# Altium project KVision_V1I1.PrjPcb (part 1 of 2)
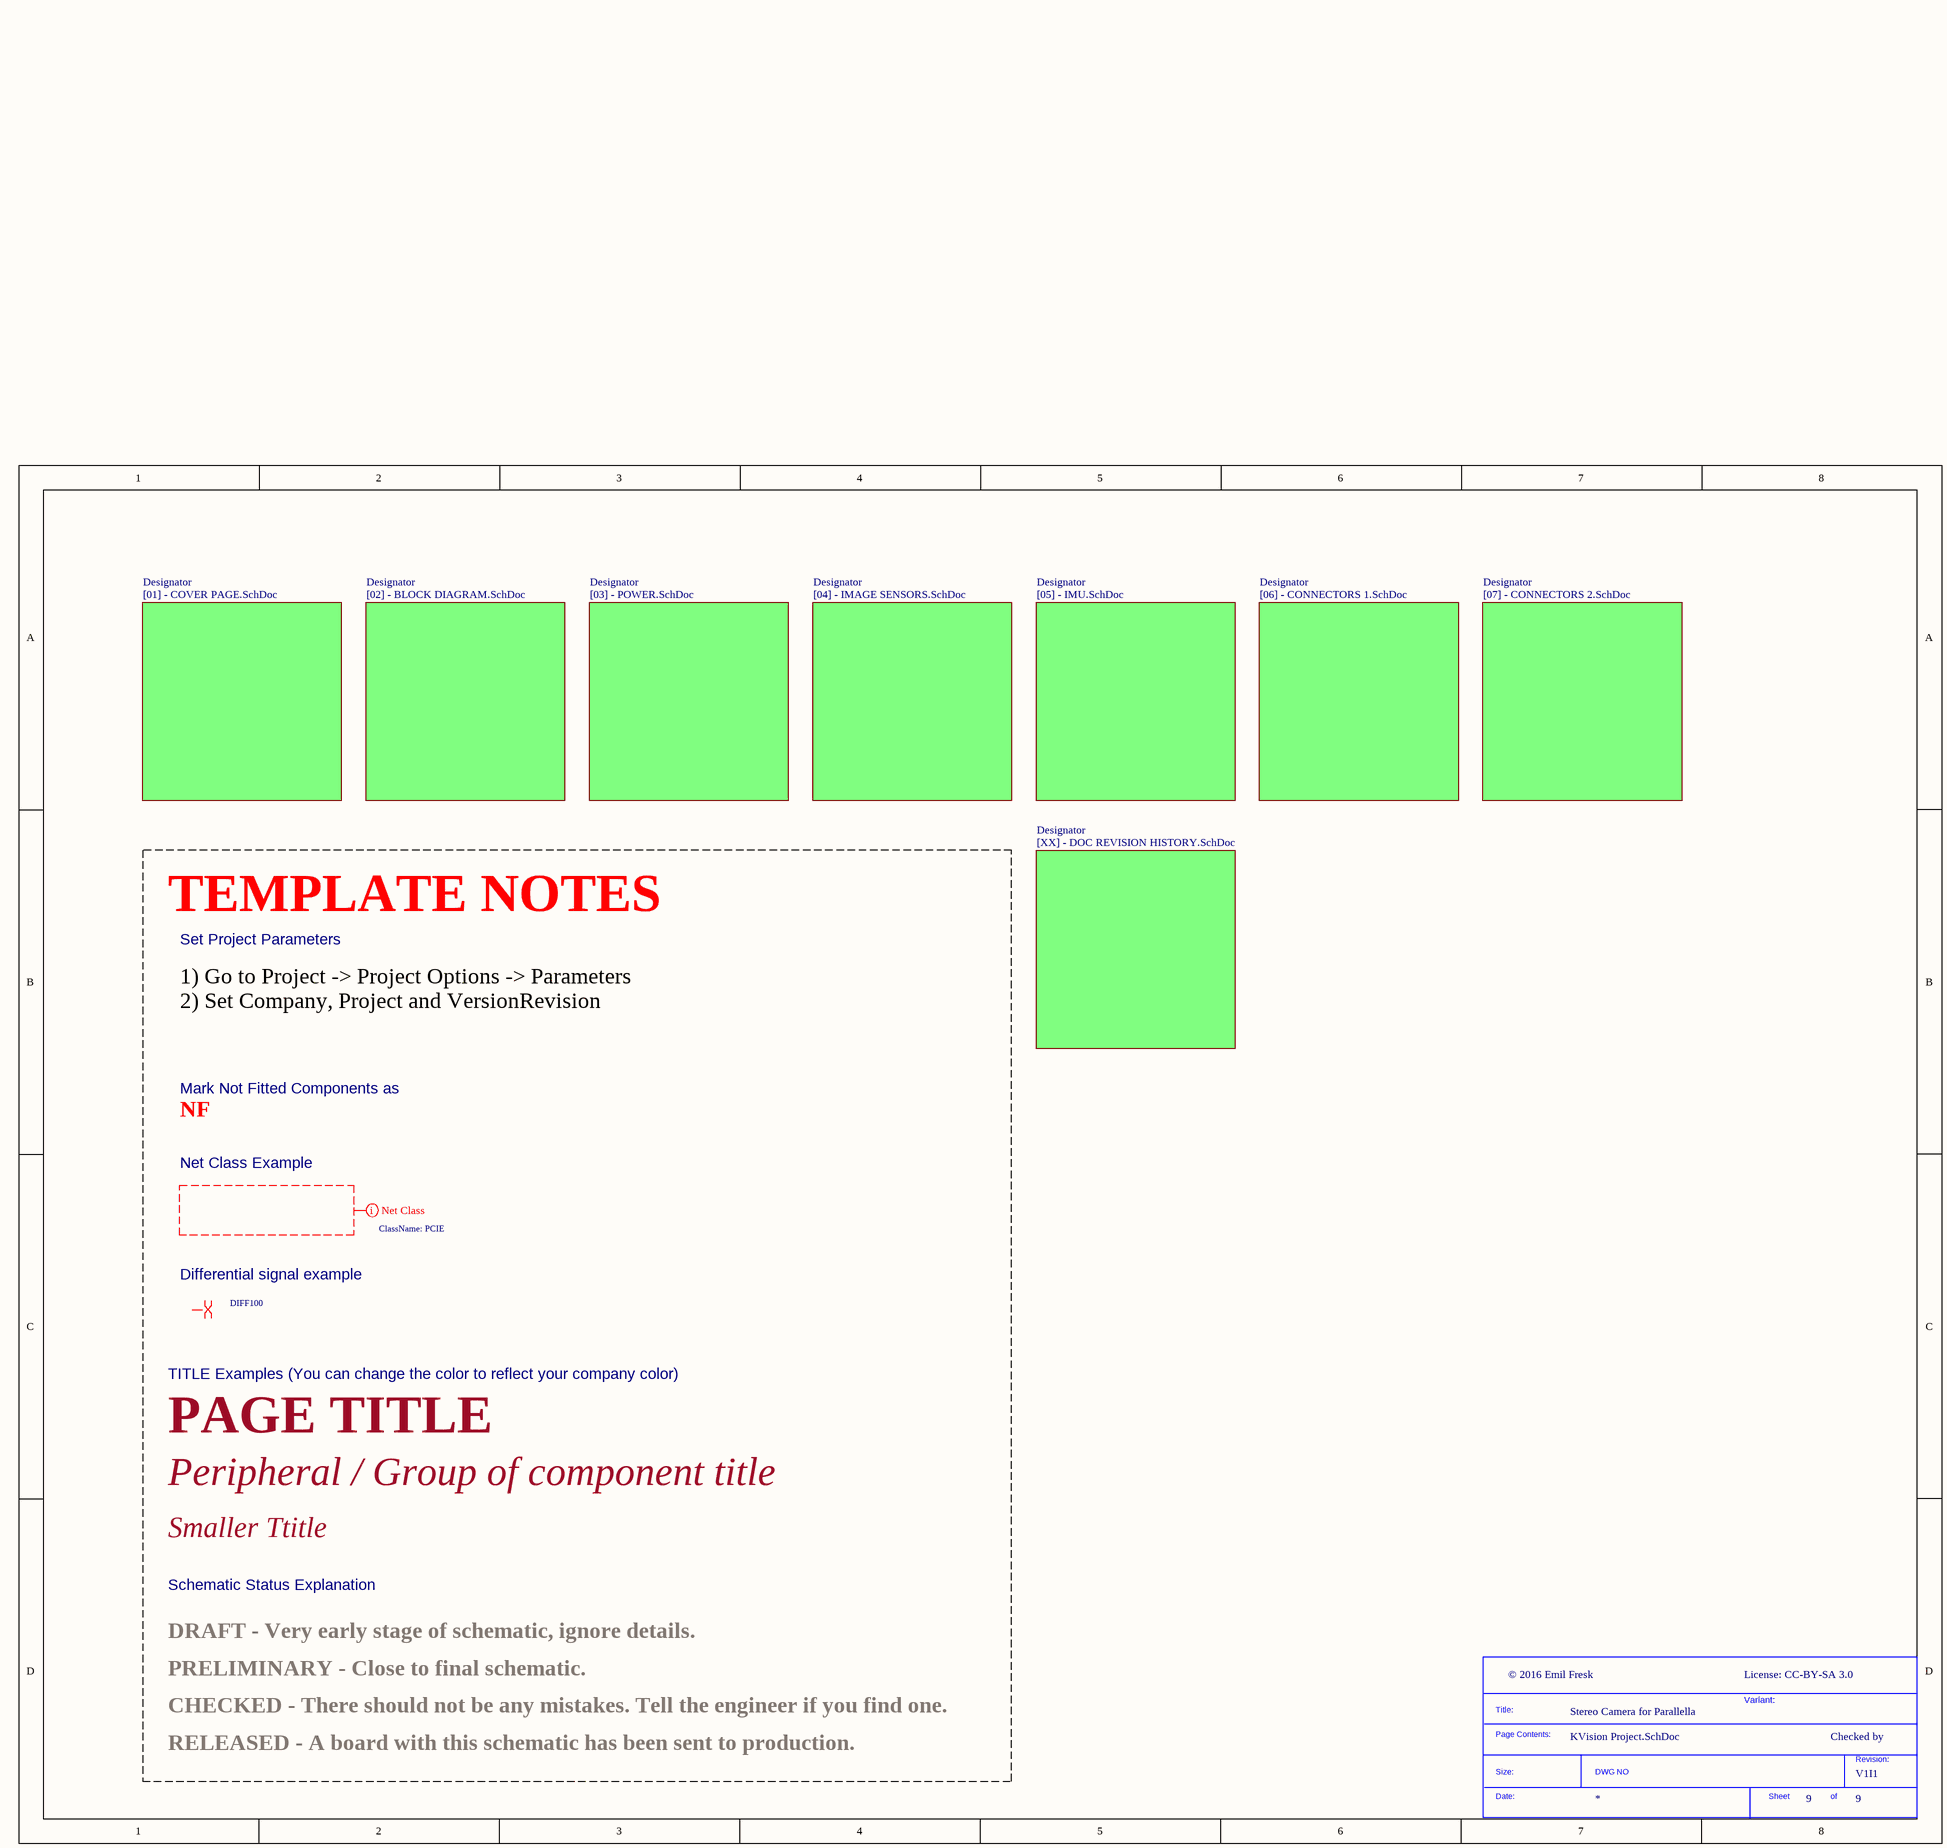
[diagram p0: KVision Project.SchDoc]
VersionRevision: V1I1; Project: Stereo Camera for Parallella; ConfidentialityNotice: License: CC-BY-SA 3.0; Company: © 2016 Emil Fresk
9 sheets, 105 parts. Net scope: global (net labels, ports and power ports of the same name join across sheets).
Board file: KVision_PCB_V1I1.PcbDoc
Sheets:
  KVision Project.SchDoc
    Designator = [01] - COVER PAGE.SchDoc
    Designator = [02] - BLOCK DIAGRAM.SchDoc
    Designator = [XX] - DOC REVISION HISTORY.SchDoc
    Designator = [03] - POWER.SchDoc
    Designator = [04] - IMAGE SENSORS.SchDoc
    Designator = [05] - IMU.SchDoc
    Designator = [06] - CONNECTORS 1.SchDoc
    Designator = [07] - CONNECTORS 2.SchDoc

## Sheet KVision Project.SchDoc
size A3; CompanyName: KDS; Organization: KDS; DocumentNumber: 9; Revision: V1I1; SheetNumber: 9; SheetTotal: 9; PageSetup: Record=PageOptions|CenterHorizontal=True|CenterVertical=True|PrintScale=1.07|XCorrection=1.00|YCorrection=1.00|PrintKind=1|BorderSize=5000000|LeftOffset=0|BottomOffset=0|Orientation=2|PaperLength=1000|PaperWidth=1000|Scale=100|PaperSource=7|PrintQuality=-3|MediaType=1|DitherType=10|PrintScaleMode=1|PaperKind=A3|PaperIndex=8; ProjectName: KDS C6A816x Module

### Parts
(Parts that share a designator on the sheet are numbered #1, #2 ... from top to bottom, then left to right.)
*#1  SDTitleBlock  (value not drawn)  (graphical)

### Sub-sheets
Designator = [01] - COVER PAGE.SchDoc: no entries
Designator = [02] - BLOCK DIAGRAM.SchDoc: no entries
Designator = [XX] - DOC REVISION HISTORY.SchDoc: no entries
Designator = [03] - POWER.SchDoc: no entries
Designator = [04] - IMAGE SENSORS.SchDoc: no entries
Designator = [05] - IMU.SchDoc: no entries
Designator = [06] - CONNECTORS 1.SchDoc: no entries
Designator = [07] - CONNECTORS 2.SchDoc: no entries

### Layout directives
net class PCIE: (no net found under the mark)
differential pair; net class DIFF100: (no net found under the mark)

### Notes on the sheet
- TEMPLATE NOTES
- Set Project Parameters
- 1) Go to Project -> Project Options -> Parameters
  2) Set Company, Project and VersionRevision
- NF
- Mark Not Fitted Components as
- Net Class Example
- Differential signal example
- TITLE Examples (You can change the color to reflect your company color)
- PAGE TITLE
- Peripheral / Group of component title
- Smaller Ttitle
- Schematic Status Explanation
- PRELIMINARY - Close to final schematic.
- DRAFT - Very early stage of schematic, ignore details.
- CHECKED - There should not be any mistakes. Tell the engineer if you find one.
- Variant:
- Checked by
- RELEASED - A board with this schematic has been sent to production.
- (in symbol SDTitleBlock) Title:; Page Contents:; Revision:; Size:; DWG NO; Date:; Sheet; of

## Sheet [01] - COVER PAGE.SchDoc
size A3; DocumentNumber: 1; SheetNumber: 1; SheetTotal: 9
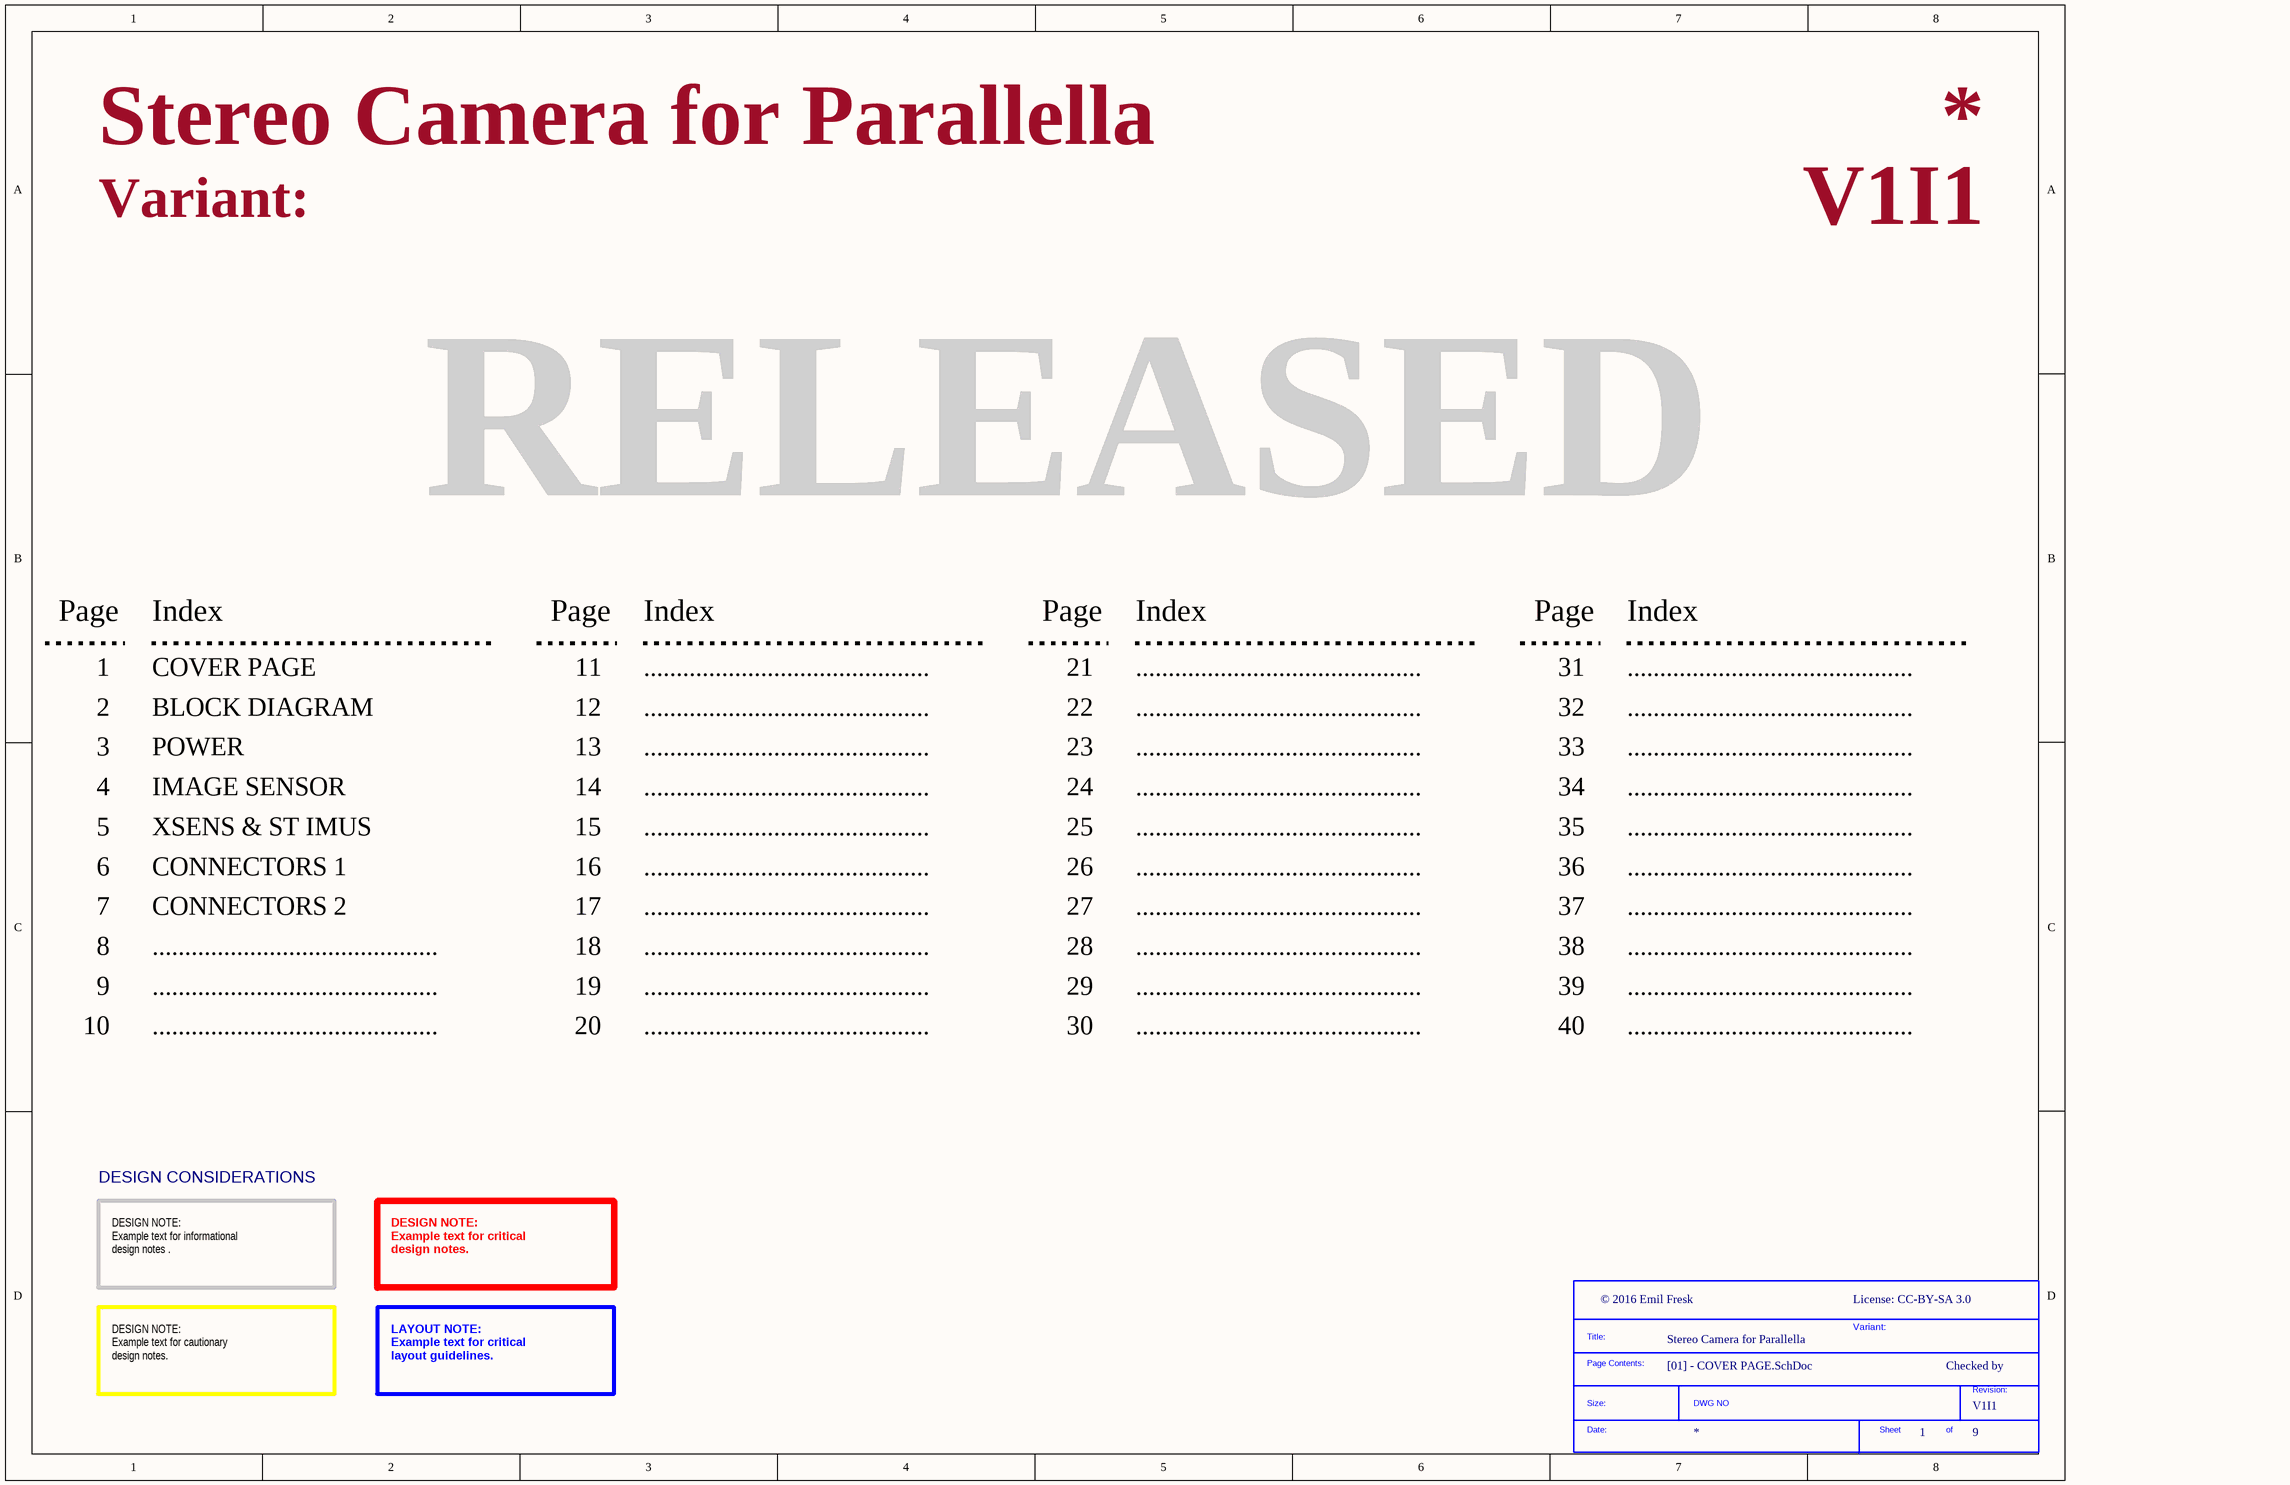
[diagram p1: [01] - COVER PAGE.SchDoc]

### Parts
(Parts that share a designator on the sheet are numbered #1, #2 ... from top to bottom, then left to right.)
*#2  SDTitleBlock  (value not drawn)  (graphical)

### Notes on the sheet
- Variant:
- RELEASED
- Page
- Index
- 1
- COVER PAGE
- 11
- ............................................
- 21
- 31
- 2
- 3
- BLOCK DIAGRAM
- POWER
- 12
- 13
- 22
- 23
- 32
- 33
- 4
- 5
- IMAGE SENSOR
- XSENS & ST IMUS
- 14
- 15
- 24
- 25
- 34
- 35
- 6
- CONNECTORS 1
- 16
- 26
- 36
- 7
- 8
- CONNECTORS 2
- 17
- 18
- 27
- 28
- 37
- 38
- 9
- 10
- 19
- 20
- 29
- 30
- 39
- 40
- DESIGN CONSIDERATIONS
- DESIGN NOTE:
  Example text for informational
  design notes .
- DESIGN NOTE:
  Example text for critical
  design notes.
- Checked by
- DESIGN NOTE:
  Example text for cautionary
  design notes.
- LAYOUT NOTE:
  Example text for critical
  layout guidelines.
- (in symbol SDTitleBlock) Title:; Page Contents:; Revision:; Size:; DWG NO; Date:; Sheet; of

## Sheet [02] - BLOCK DIAGRAM.SchDoc
size A3; DocumentNumber: 2; SheetNumber: 2; SheetTotal: 9
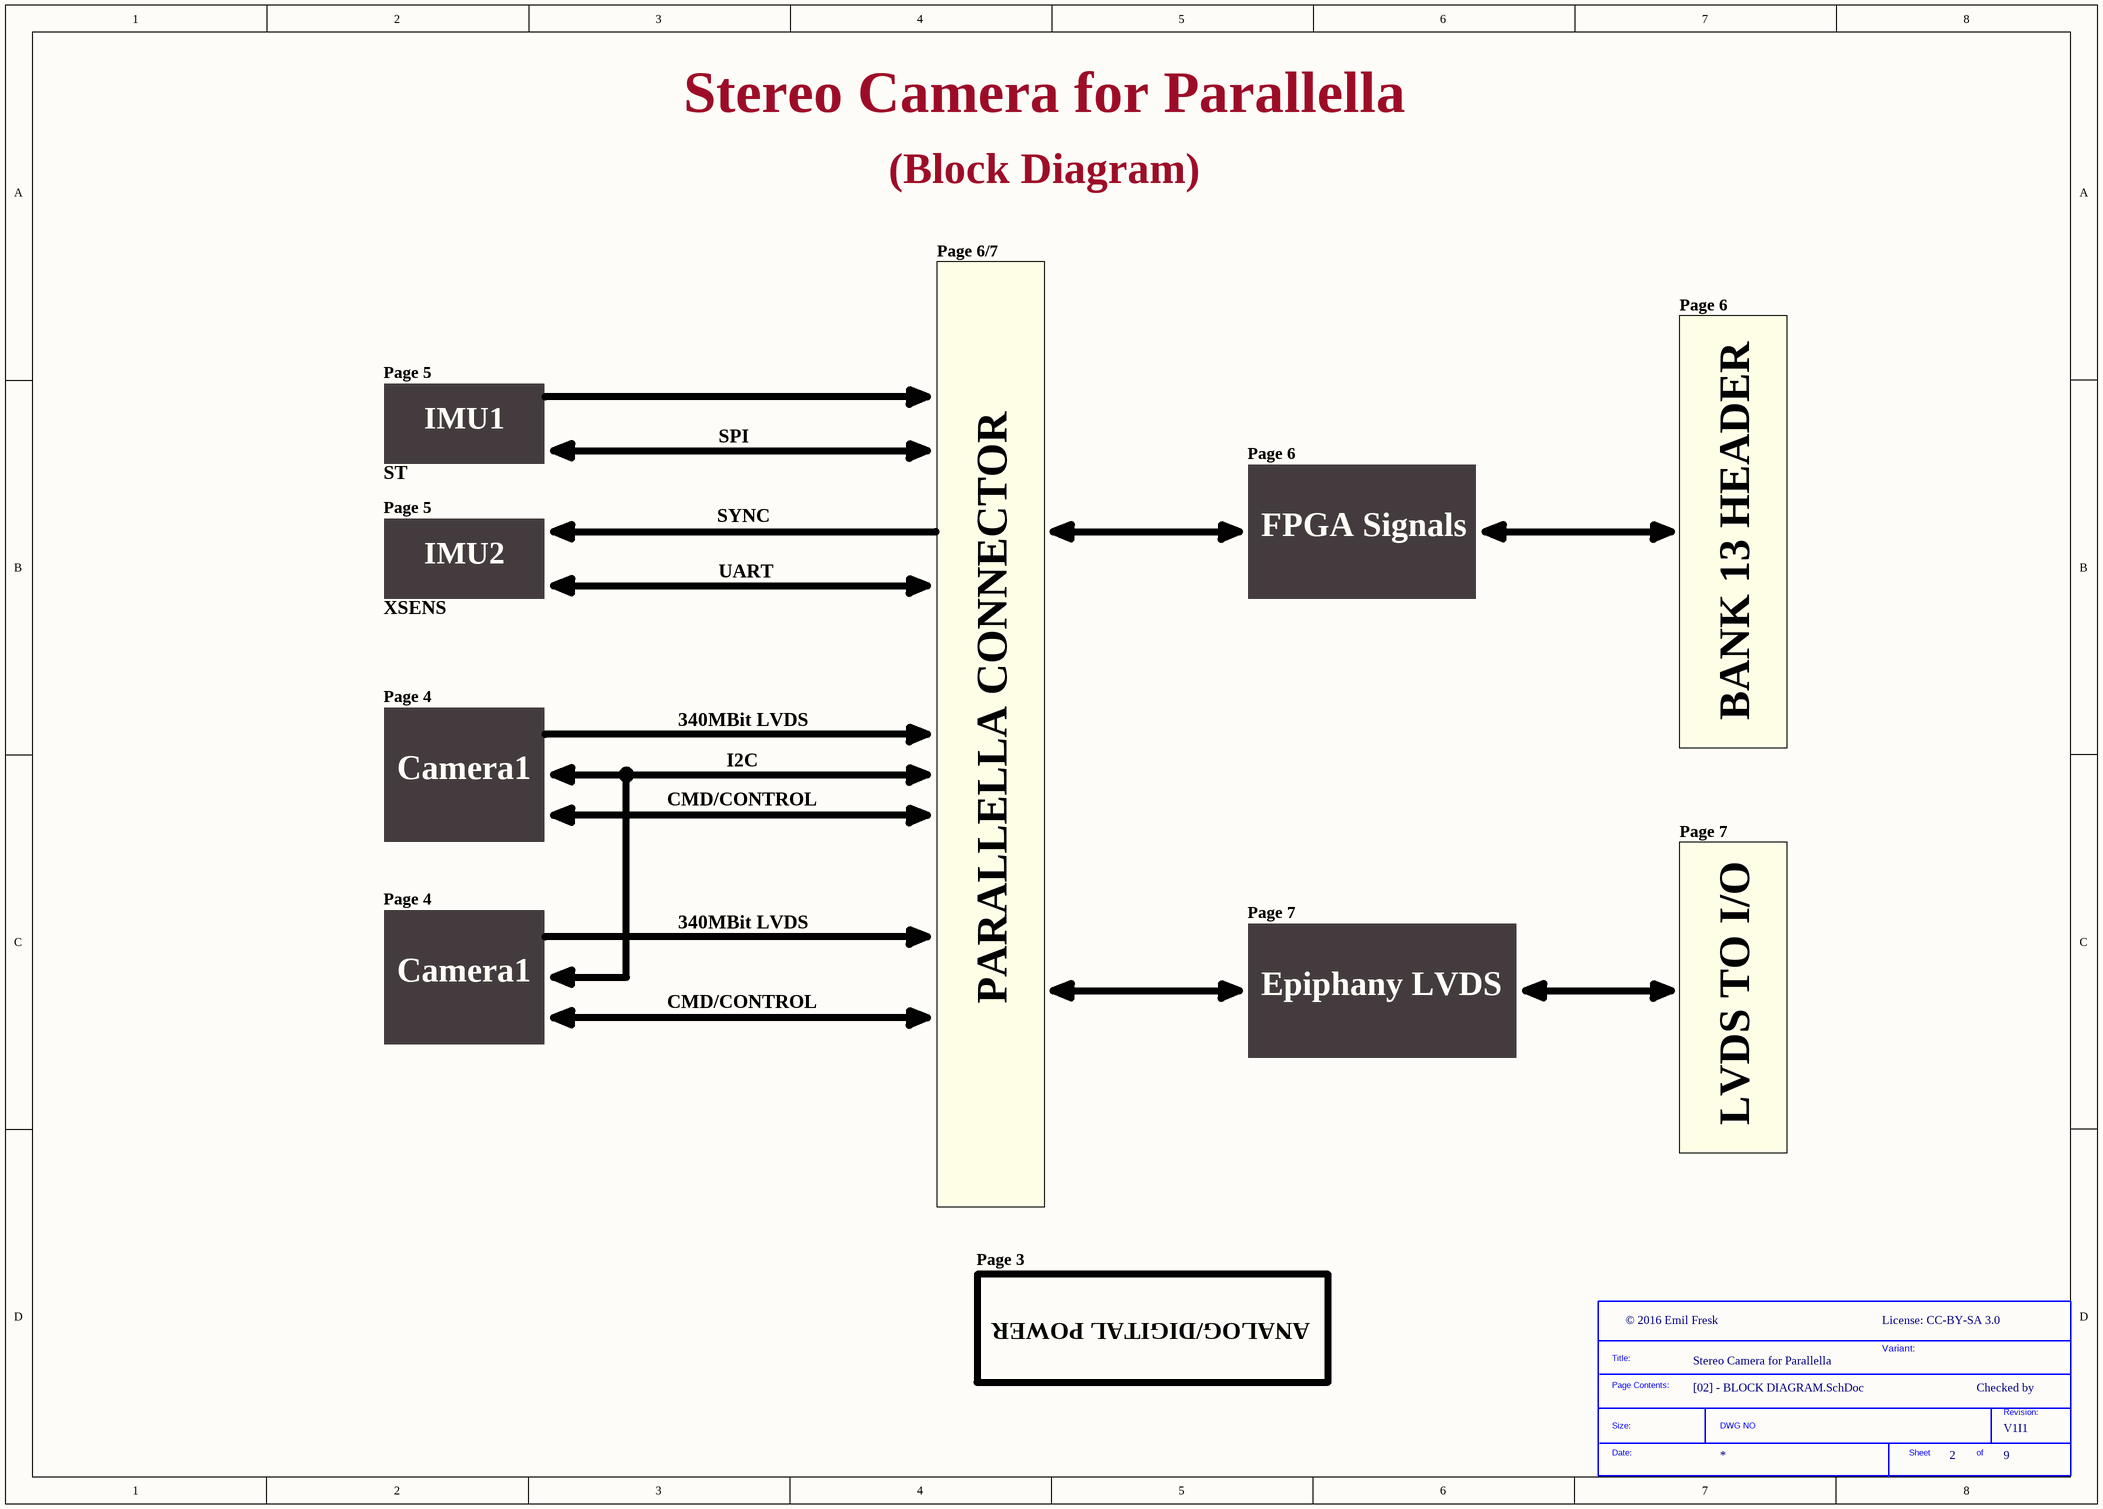
[diagram p2: [02] - BLOCK DIAGRAM.SchDoc]

### Parts
(Parts that share a designator on the sheet are numbered #1, #2 ... from top to bottom, then left to right.)
*#3  SDTitleBlock  (value not drawn)  (graphical)

### Notes on the sheet
- (Block Diagram)
- Page 6/7
- Page 6
- Page 5
- IMU1
- SPI
- ST
- IMU2
- SYNC
- UART
- FPGA Signals
- XSENS
- Page 4
- BANK 13 HEADER
- Camera1
- 340MBit LVDS
- I2C
- CMD/CONTROL
- Page 7
- PARALLELLA CONNECTOR
- Epiphany LVDS
- LVDS TO I/O
- Page 3
- ANALOG/DIGITAL POWER
- CLOCKS (CPU & PCIE)
- Variant:
- Checked by
- (in symbol SDTitleBlock) Title:; Page Contents:; Revision:; Size:; DWG NO; Date:; Sheet; of

## Sheet [XX] - DOC REVISION HISTORY.SchDoc
size A3; DocumentNumber: 8; SheetNumber: 8; SheetTotal: 9
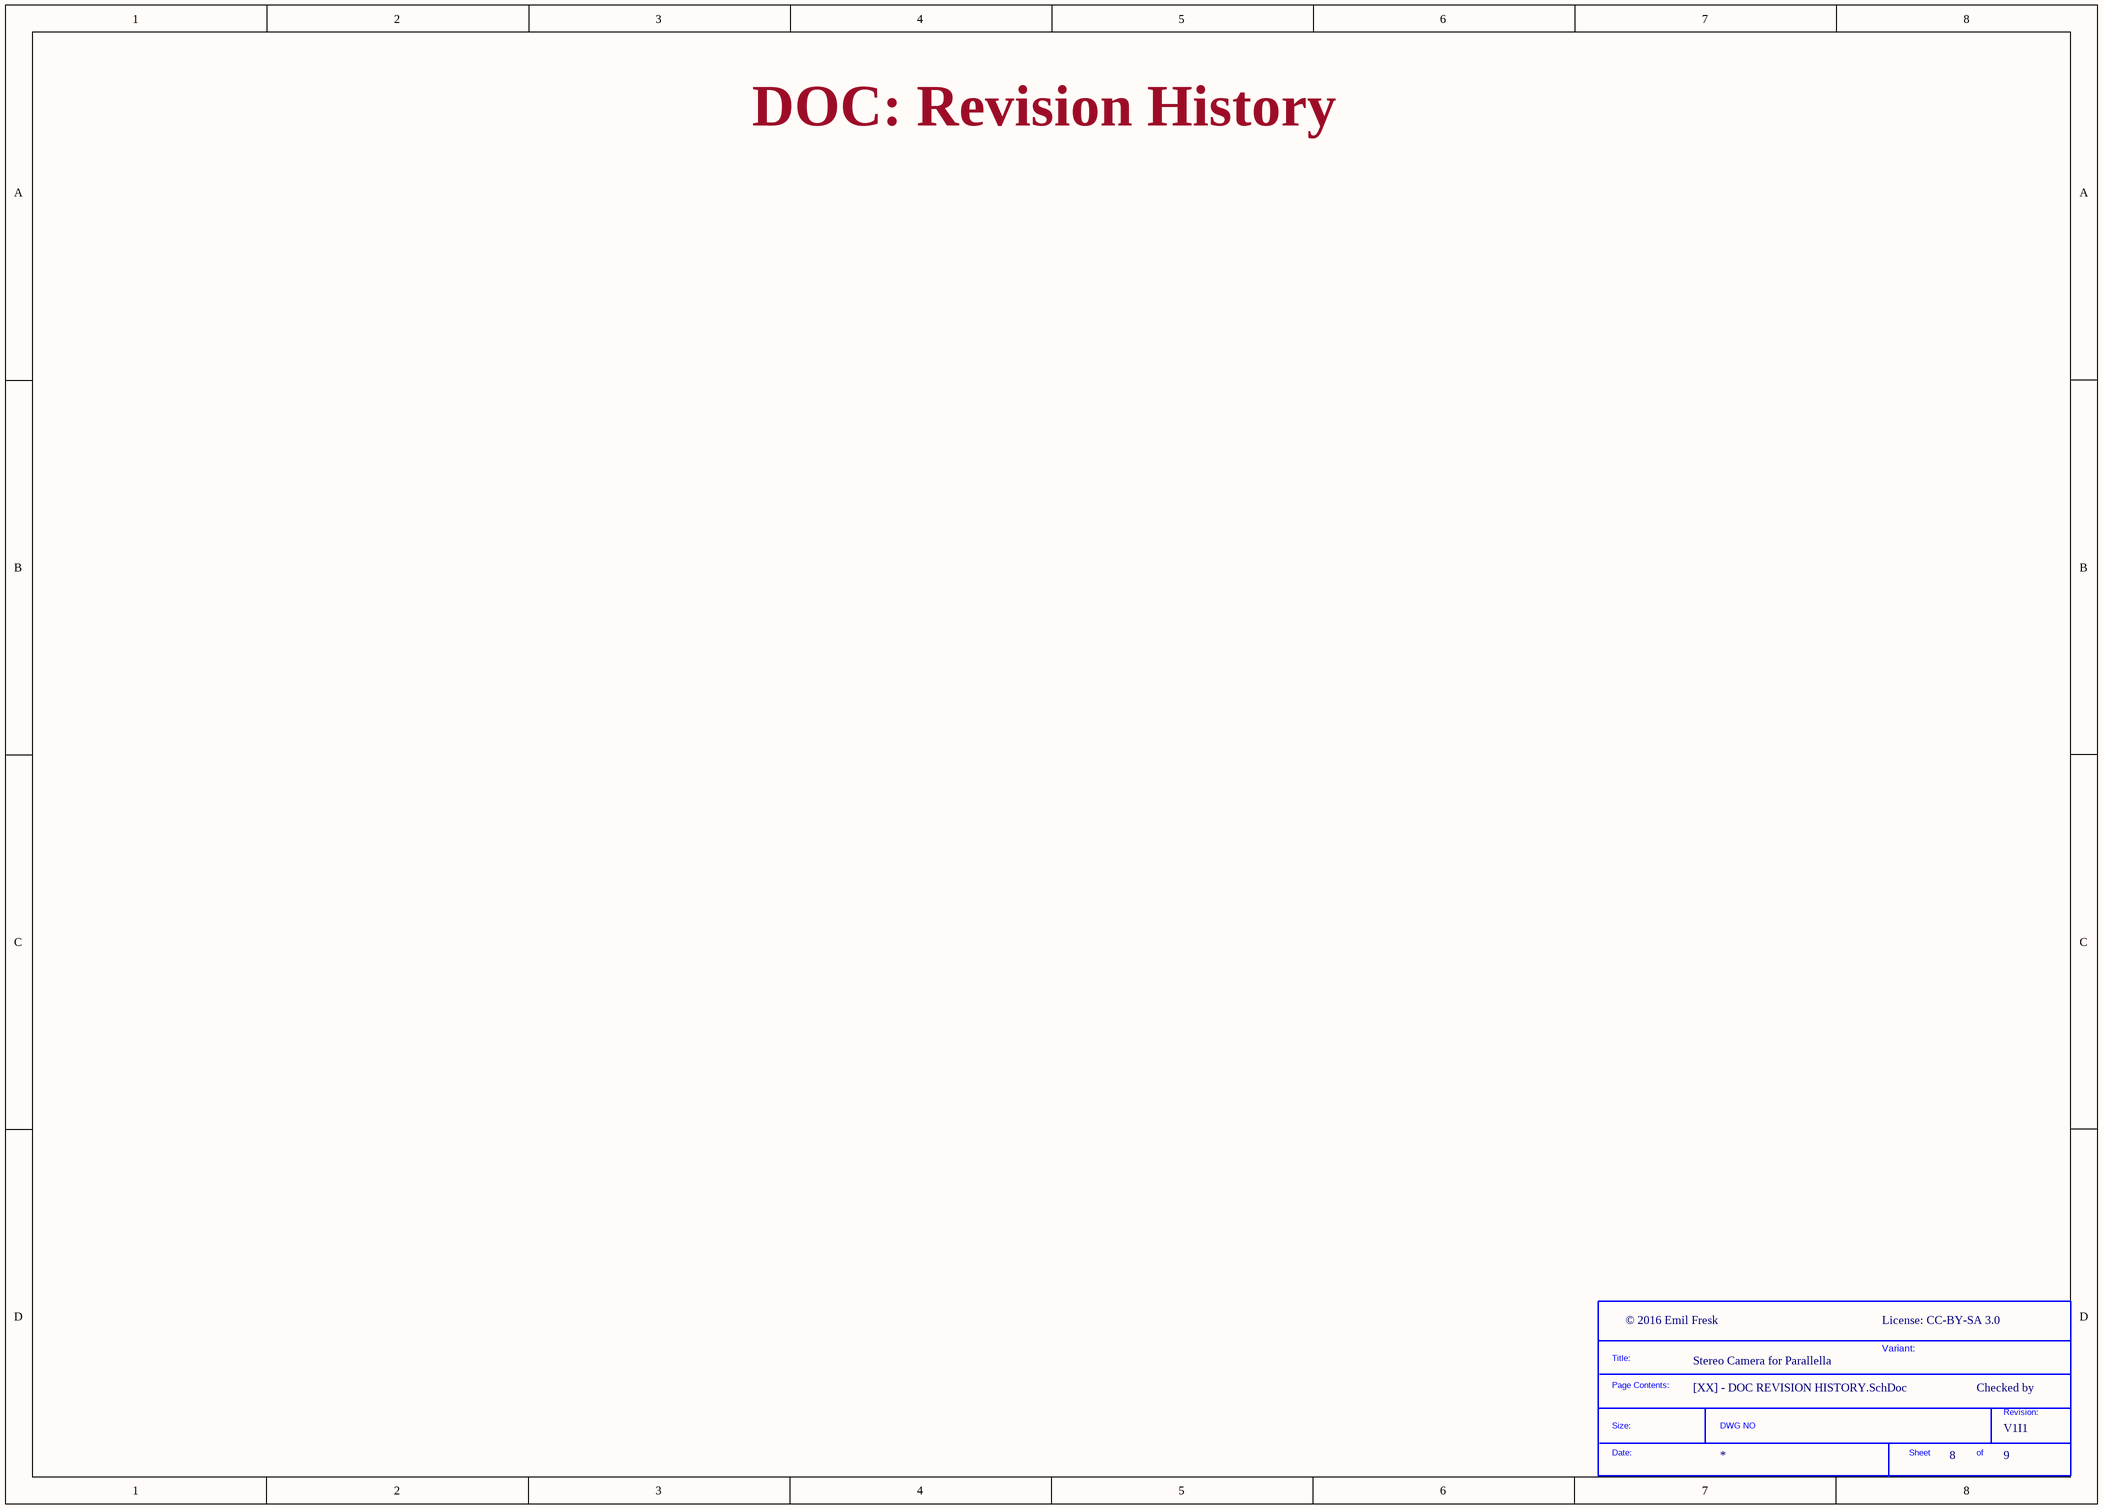
[diagram p3: [XX] - DOC REVISION HISTORY.SchDoc]

### Parts
(Parts that share a designator on the sheet are numbered #1, #2 ... from top to bottom, then left to right.)
*#4  SDTitleBlock  (value not drawn)  (graphical)

### Notes on the sheet
- DOC: Revision History
- CLOCKS (CPU & PCIE)
- Variant:
- Checked by
- (in symbol SDTitleBlock) Title:; Page Contents:; Revision:; Size:; DWG NO; Date:; Sheet; of

## Sheet [03] - POWER.SchDoc
size A3; DocumentNumber: 3; SheetNumber: 3; SheetTotal: 9
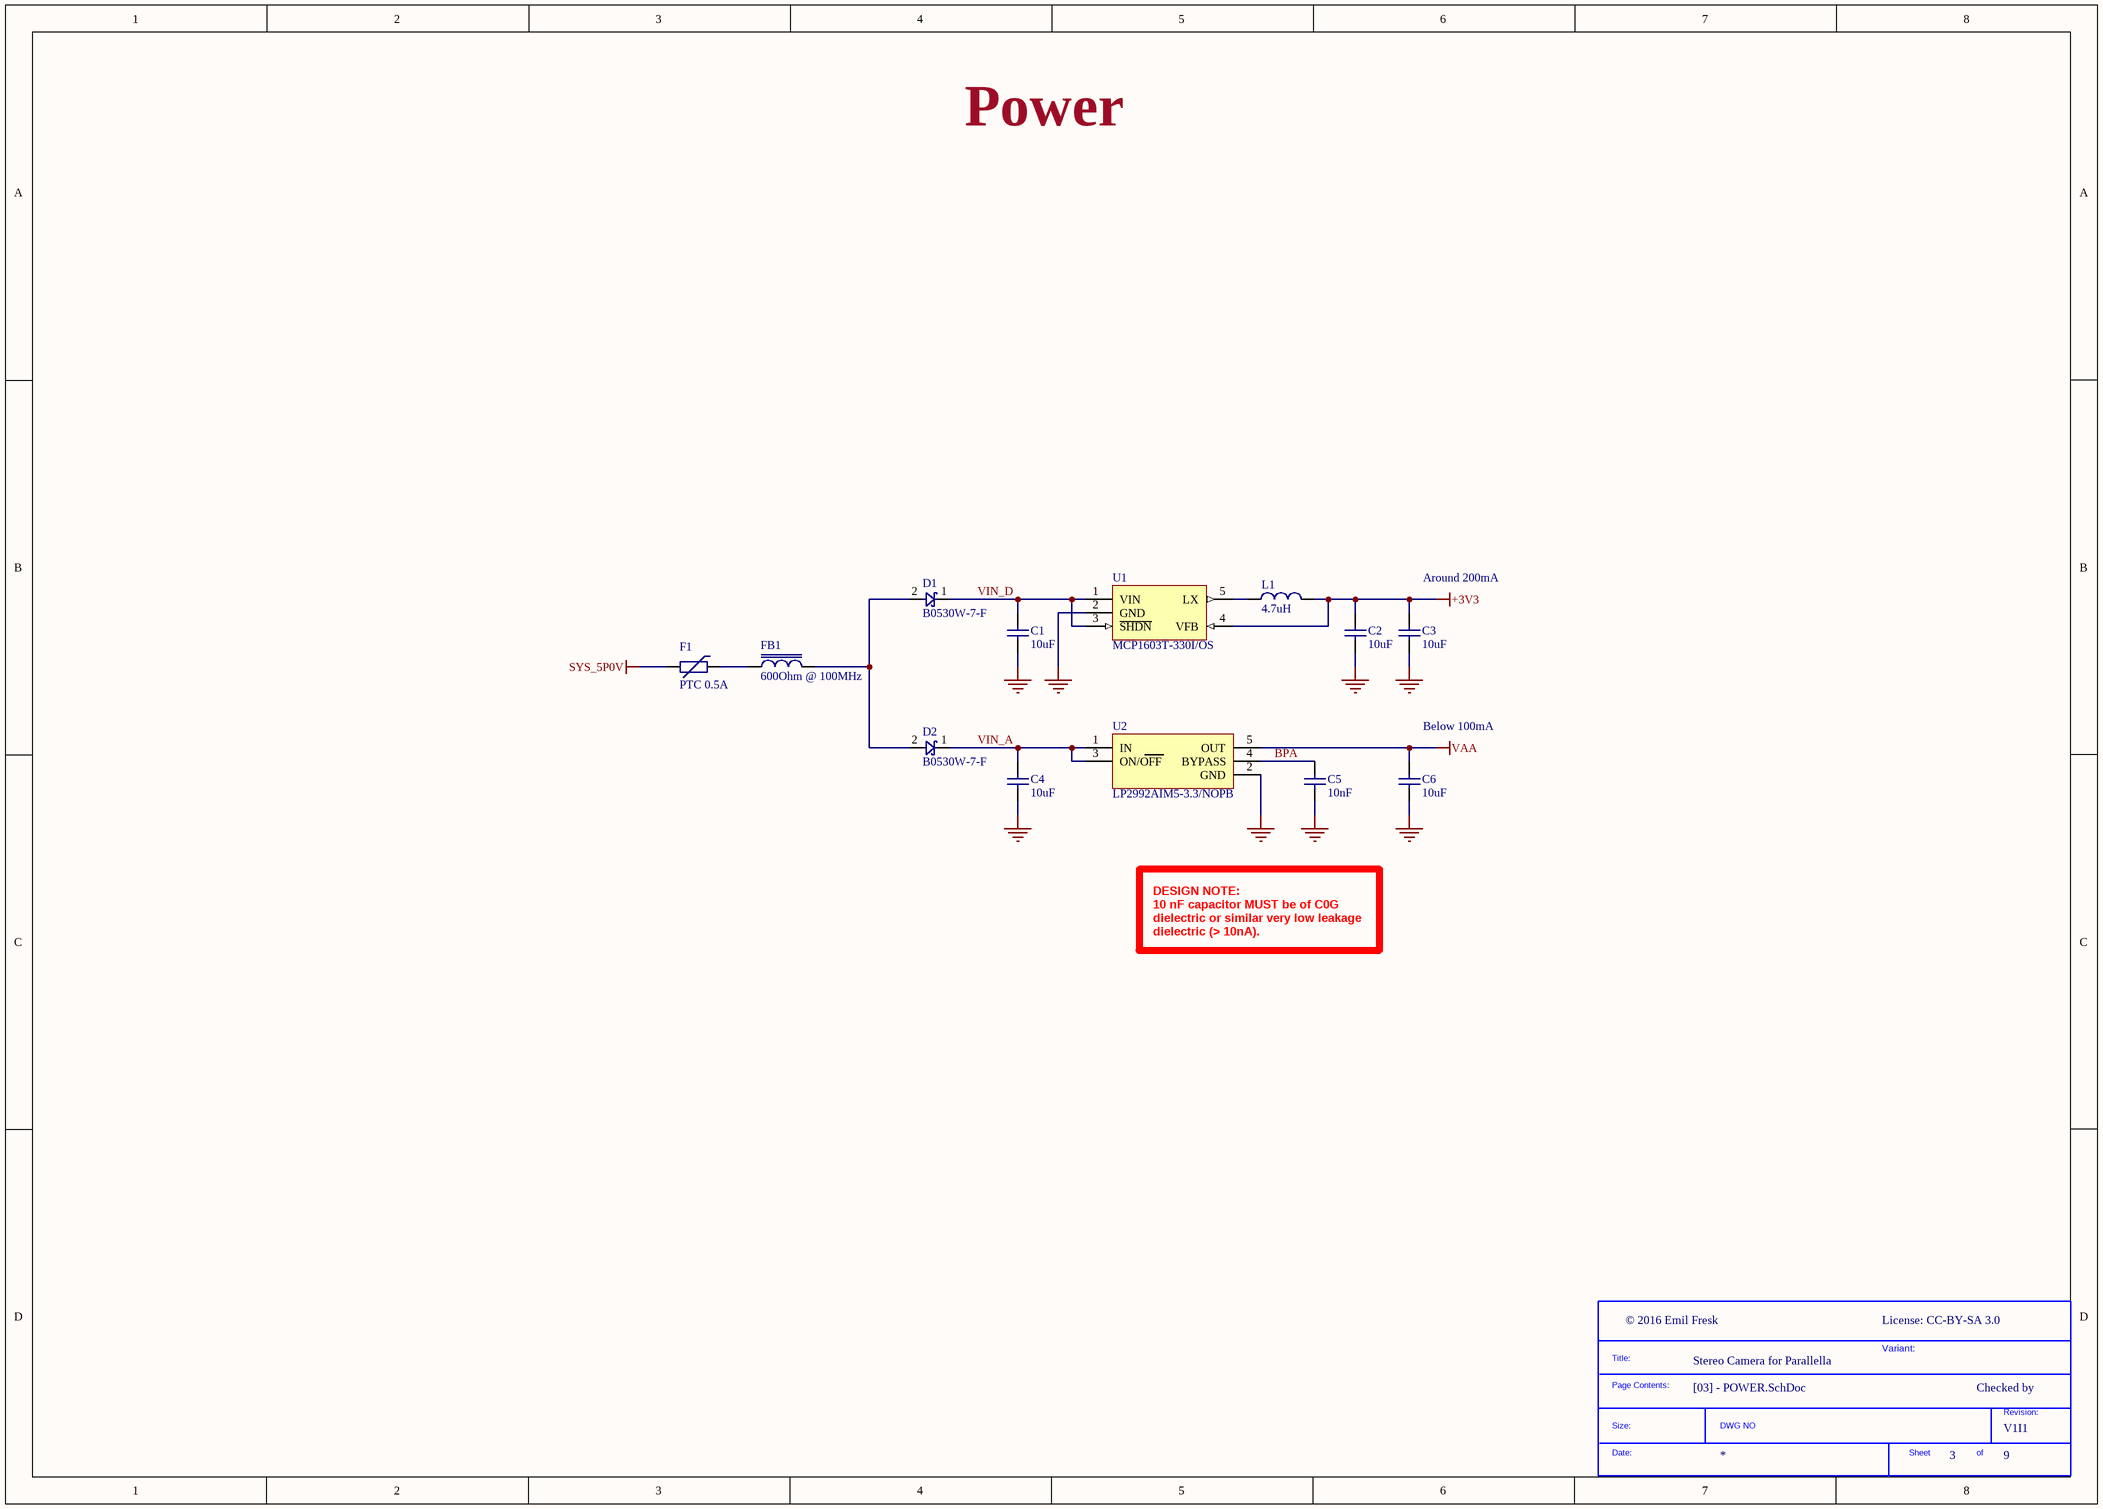
[diagram p4: [03] - POWER.SchDoc]

### Parts
(Parts that share a designator on the sheet are numbered #1, #2 ... from top to bottom, then left to right.)
*#5  SDTitleBlock  (value not drawn)  (graphical)
C1  10uF  [C0603L]
C2  10uF  [C0603L]
C3  10uF  [C0603L]
C4  10uF  [C0603L]
C5  10nF  [C0603L]
C6  10uF  [C0603L]
D1  B0530W-7-F  [SOD123_DIODE]
D2  B0530W-7-F  [SOD123_DIODE]
F1  PTC 0.5A  [FUSE_1812]
FB1  600Ohm @ 100MHz  [R0603L]
L1  4.7uH  [L_SRN3015]
U1  MCP1603T-330I/OS  [SOT23-5N]
U2  LP2992AIM5-3.3/NOPB  [SOT23-5N]

### Nets
+3V3: C2.1 C3.1 L1.2 U1.4(VFB)
GND: C1.2 C2.2 C3.2 C4.2 C5.2 C6.2 U1.2(GND) U2.2(GND)
SYS_5P0V: F1.1
VAA: C6.1 U2.5(OUT)
BPA: C5.1 U2.4(BYPASS)
VIN_A: C4.1 D2.1 U2.1(IN) U2.3(ON/OFF)
VIN_D: C1.1 D1.1 U1.1(VIN) U1.3(~{SHDN})
NetD1_2: D1.2 D2.2 FB1.2
NetF1_2: F1.2 FB1.1
NetL1_1: L1.1 U1.5(LX)

### Notes on the sheet
- Power
- (near C3) Around 200mA
- (near C6) Below 100mA
- DESIGN NOTE:
  10 nF capacitor MUST be of C0G dielectric or similar very low leakage dielectric (> 10nA).
- CLOCKS (CPU & PCIE)
- Variant:
- Checked by
- (in symbol SDTitleBlock) Title:; Page Contents:; Revision:; Size:; DWG NO; Date:; Sheet; of

### Library data of the parts
C1-C4 C6 = GRM188R61C106MA73D: CAP CER 10UF 16V 20% X5R 0603; Manufacturer: Murata Electronics North America; Capacitance: 10µF; Supplier 1: Digi-Key; Manufacturer Part Number: GRM188R61C106MA73D; RoHS: RoHS Compliant; Category: Capacitors; Stock 1: 1868; Pricing 1: 1=0.18, 10=0.171, 25=0.146, 50=0.1242, 100=0.1195, 250=0.10728, 500=0.10238, 1000=0.08532 (EUR); Packaging: Cut Tape (CT); Tolerance: ±20%; Voltage - Rated: 16V; Temperature Coefficient: X5R; Mounting Type: Surface Mount, MLCC; Operating Temperature: -55°C ~ 85°C; Applications: General Purpose; Ratings: -; Package / Case: 0603 (1608 Metric); Size / Dimension: 0.063" L x 0.031" W (1.60mm x 0.80mm); Height - Seated (Max): -; Thickness (Max): 0.031" (0.80mm); Lead Spacing: -; Features: -; Lead Style: -; ComponentLink1URL: http://www.murata.com/~/media/webrenewal/support/library/catalog/products/capacitor/mlcc/c02e.ashx; ComponentLink1Description: http://www.murata.com/~/media/webrenewal/support/library/catalog/products/capacitor/mlcc/c02e.ashx; Supplier Part Number 1: 490-7201-1-ND
C5 = C1608C0G1E103J080AA: CAP CER 10000PF 25V 5% C0G 0603; Manufacturer: TDK Corporation; Temperature Coefficient: C0G, NP0; Supplier 1: Digi-Key; Manufacturer Part Number: C1608C0G1E103J080AA; RoHS: RoHS Compliant; Category: Capacitors; Stock 1: 297001; Pricing 1: 1=0.35, 10=0.287, 100=0.1433, 250=0.10748, 500=0.09496, 1000=0.0842 (EUR); Packaging: Cut Tape (CT); Capacitance: 10000pF; Tolerance: ±5%; Voltage - Rated: 25V; Mounting Type: Surface Mount, MLCC; Operating Temperature: -55°C ~ 125°C; Applications: General Purpose; Ratings: -; Package / Case: 0603 (1608 Metric); Size / Dimension: 0.063" L x 0.031" W (1.60mm x 0.80mm); Height - Seated (Max): -; Thickness (Max): 0.037" (0.95mm); Lead Spacing: -; Features: -; Lead Style: -; ComponentLink1URL: http://product.tdk.com/en/catalog/datasheets/mlcc_commercial_general_en.pdf; ComponentLink1Description: http://product.tdk.com/en/catalog/datasheets/mlcc_commercial_general_en.pdf; Supplier Part Number 1: 445-2664-1-ND
D1 D2 = B0530W-7-F: DIODE SCHOTTKY 30V 500MA SOD123; Manufacturer: Diodes Incorporated; Voltage - Forward (Vf) (Max) @ If: 430mV @ 500mA; Speed: Fast Recovery =< 500ns, > 200mA (Io); Current - Reverse Leakage @ Vr: 130µA @ 30V; Capacitance @ Vr, F: 170pF @ 0V, 1MHz; Supplier 1: Digi-Key; Manufacturer Part Number: B0530W-7-F; RoHS: RoHS Compliant; Category: Discrete Semiconductor Products; Stock 1: 43101; Pricing 1: 1=0.31, 10=0.283, 25=0.2036, 100=0.1582, 250=0.09944, 500=0.08474, 1000=0.05774 (EUR); Packaging: Cut Tape (CT); Diode Type: Schottky; Voltage - DC Reverse (Vr) (Max): 30V; Current - Average Rectified (Io): 500mA; Reverse Recovery Time (trr): -; Mounting Type: Surface Mount; Package / Case: SOD-123; Supplier Device Package: SOD-123; Operating Temperature - Junction: -65°C ~ 125°C; ComponentLink1URL: http://www.diodes.com/datasheets/ds30139.pdf; ComponentLink1Description: http://www.diodes.com/datasheets/ds30139.pdf; Supplier Part Number 1: B0530W-FDICT-ND
F1 = 0ZCG0050AF2C: PTC RESETTBLE 0.50A 30V CHIP 181; Manufacturer: Bel Fuse Inc; Current - Max: 100A; Current - Hold (Ih) (Max): 500mA; Current - Trip (It): 1A; R Min/Max: 0.150 ~ 1.000 Ohm; Time to Trip: 0.15s; Supplier 1: Digi-Key; Manufacturer Part Number: 0ZCG0050AF2C; RoHS: RoHS Compliant; Category: Circuit Protection; Stock 1: 12558; Pricing 1: 1=0.12, 10=0.11, 25=0.1016, 100=0.0912, 250=0.08128, 500=0.06772, 1000=0.06417 (EUR); Packaging: Cut Tape (CT); Voltage - Max: 30V; Package / Case: 1812 (4532 Metric), Concave; ComponentLink1URL: http://www.belfuse.com/pdfs/0ZCG.pdf; ComponentLink1Description: http://www.belfuse.com/pdfs/0ZCG.pdf; Supplier Part Number 1: 507-1762-1-ND
FB1 = MPZ1608S601ATA00: FERRITE CHIP BEAD 600 OHM SMD; Manufacturer: TDK Corporation; Current Rating: 1A; DC Resistance (DCR): 150 mOhm Max; Filter Type: Differential Mode - Single; Supplier 1: Digi-Key; Manufacturer Part Number: MPZ1608S601ATA00; RoHS: RoHS Compliant; Category: Filters; Stock 1: 108962; Pricing 1: 1=0.09, 10=0.07, 100=0.0415, 250=0.0302, 500=0.02768, 1000=0.02391 (EUR); Packaging: Cut Tape (CT); Impedance @ Frequency: 600 Ohm @ 100MHz; Package / Case: 0603 (1608 Metric); Mounting Type: Surface Mount; Height (Max): 0.037" (0.95mm); Size / Dimension: 0.063" L x 0.031" W (1.60mm x 0.80mm); ComponentLink1URL: http://product.tdk.com/en/catalog/datasheets/beads_commercial_power_mpz_en.pdf; ComponentLink1Description: http://product.tdk.com/en/catalog/datasheets/beads_commercial_power_mpz_en.pdf; Supplier Part Number 1: 445-2205-1-ND
L1 = SRN3015-4R7M: FIXED IND 4.7UH 1.4A 136 MOHM; Manufacturer: Bourns Inc.; Type: Wirewound; Material - Core: Ferrite; Inductance: 4.7µH; Tolerance: ±20%; Current - Saturation: 1.2A; Shielding: Shielded; DC Resistance (DCR): 136 mOhm Max; Frequency - Self Resonant: 65MHz; Frequency - Test: 1MHz; Supplier 1: Digi-Key; Manufacturer Part Number: SRN3015-4R7M; RoHS: RoHS Compliant; Category: Inductors, Coils, Chokes; Stock 1: 8540; Pricing 1: 1=0.33, 10=0.293, 25=0.2744, 50=0.2378, 100=0.2195, 250=0.20856, 500=0.19026, 1000=0.16099 (EUR); Packaging: Cut Tape (CT); Current Rating: 1.4A; Q @ Freq: -; Operating Temperature: -40°C ~ 125°C; Mounting Type: Surface Mount; Package / Case: Nonstandard; Size / Dimension: 0.118" L x 0.118" W (3.00mm x 3.00mm); Height - Seated (Max): 0.059" (1.50mm); Supplier Device Package: -; ComponentLink1URL: http://www.bourns.com/data/global/pdfs/SRN3015.pdf; ComponentLink1Description: http://www.bourns.com/data/global/pdfs/SRN3015.pdf; Supplier Part Number 1: SRN3015-4R7MCT-ND
U1 = MCP1603T-330I/OS: IC REG BCK 3.3V 0.5A SYNC TSOT23; Manufacturer: Microchip Technology; Function: Step-Down; Output Configuration: Positive; Topology: Buck; Output Type: Fixed; Number of Outputs: 1; Voltage - Input (Min): 2.7V; Voltage - Input (Max): 5.5V; Current - Output: 500mA; Frequency - Switching: 2MHz; Synchronous Rectifier: Yes; Supplier 1: Digi-Key; Manufacturer Part Number: MCP1603T-330I/OS; RoHS: RoHS Compliant; Category: Integrated Circuits (ICs); Stock 1: 3738; Pricing 1: 1=1.08, 10=0.896, 25=0.75, 100=0.6769 (EUR); Packaging: Cut Tape (CT); Voltage - Output (Min/Fixed): 3.3V; Voltage - Output (Max): -; Operating Temperature: -40°C ~ 125°C (TJ); Mounting Type: Surface Mount; Package / Case: SOT-23-5 Thin, TSOT-23-5; Supplier Device Package: TSOT-23-5; ComponentLink1URL: http://www.microchip.com/mymicrochip/filehandler.aspx?ddocname=en530515; ComponentLink1Description: http://www.microchip.com/mymicrochip/filehandler.aspx?ddocname=en530515; Supplier Part Number 1: MCP1603T-330I/OSCT-ND
U2 = LP2992AIM5-3.3/NOPB: IC REG LDO 3.3V 0.25A SOT23-5; Manufacturer: Texas Instruments; Regulator Topology: Positive Fixed; Current - Output: 250mA; Voltage - Dropout (Typical): 0.45V @ 250mA; Number of Regulators: 1; Voltage - Input: Up to 16V; Supplier 1: Digi-Key; Manufacturer Part Number: LP2992AIM5-3.3/NOPB; RoHS: RoHS Compliant; Category: Integrated Circuits (ICs); Stock 1: 25697; Pricing 1: 1=1.26, 10=1.116, 25=1.0084, 50=0.9336, 100=0.8824, 250=0.7524, 500=0.66538 (EUR); Packaging: Cut Tape (CT); Voltage - Output: 3.3V; Current - Limit (Min): -; Operating Temperature: -40°C ~ 125°C; Mounting Type: Surface Mount; Package / Case: SC-74A, SOT-753; Supplier Device Package: SOT-23-5; ComponentLink1URL: http://www.ti.com/lit/ds/symlink/lp2992.pdf; ComponentLink1Description: http://www.ti.com/lit/ds/symlink/lp2992.pdf; Supplier Part Number 1: LP2992AIM5-3.3/NOPBCT-ND

## Sheet [04] - IMAGE SENSORS.SchDoc
size A3; DocumentNumber: 4; SheetNumber: 4; SheetTotal: 9
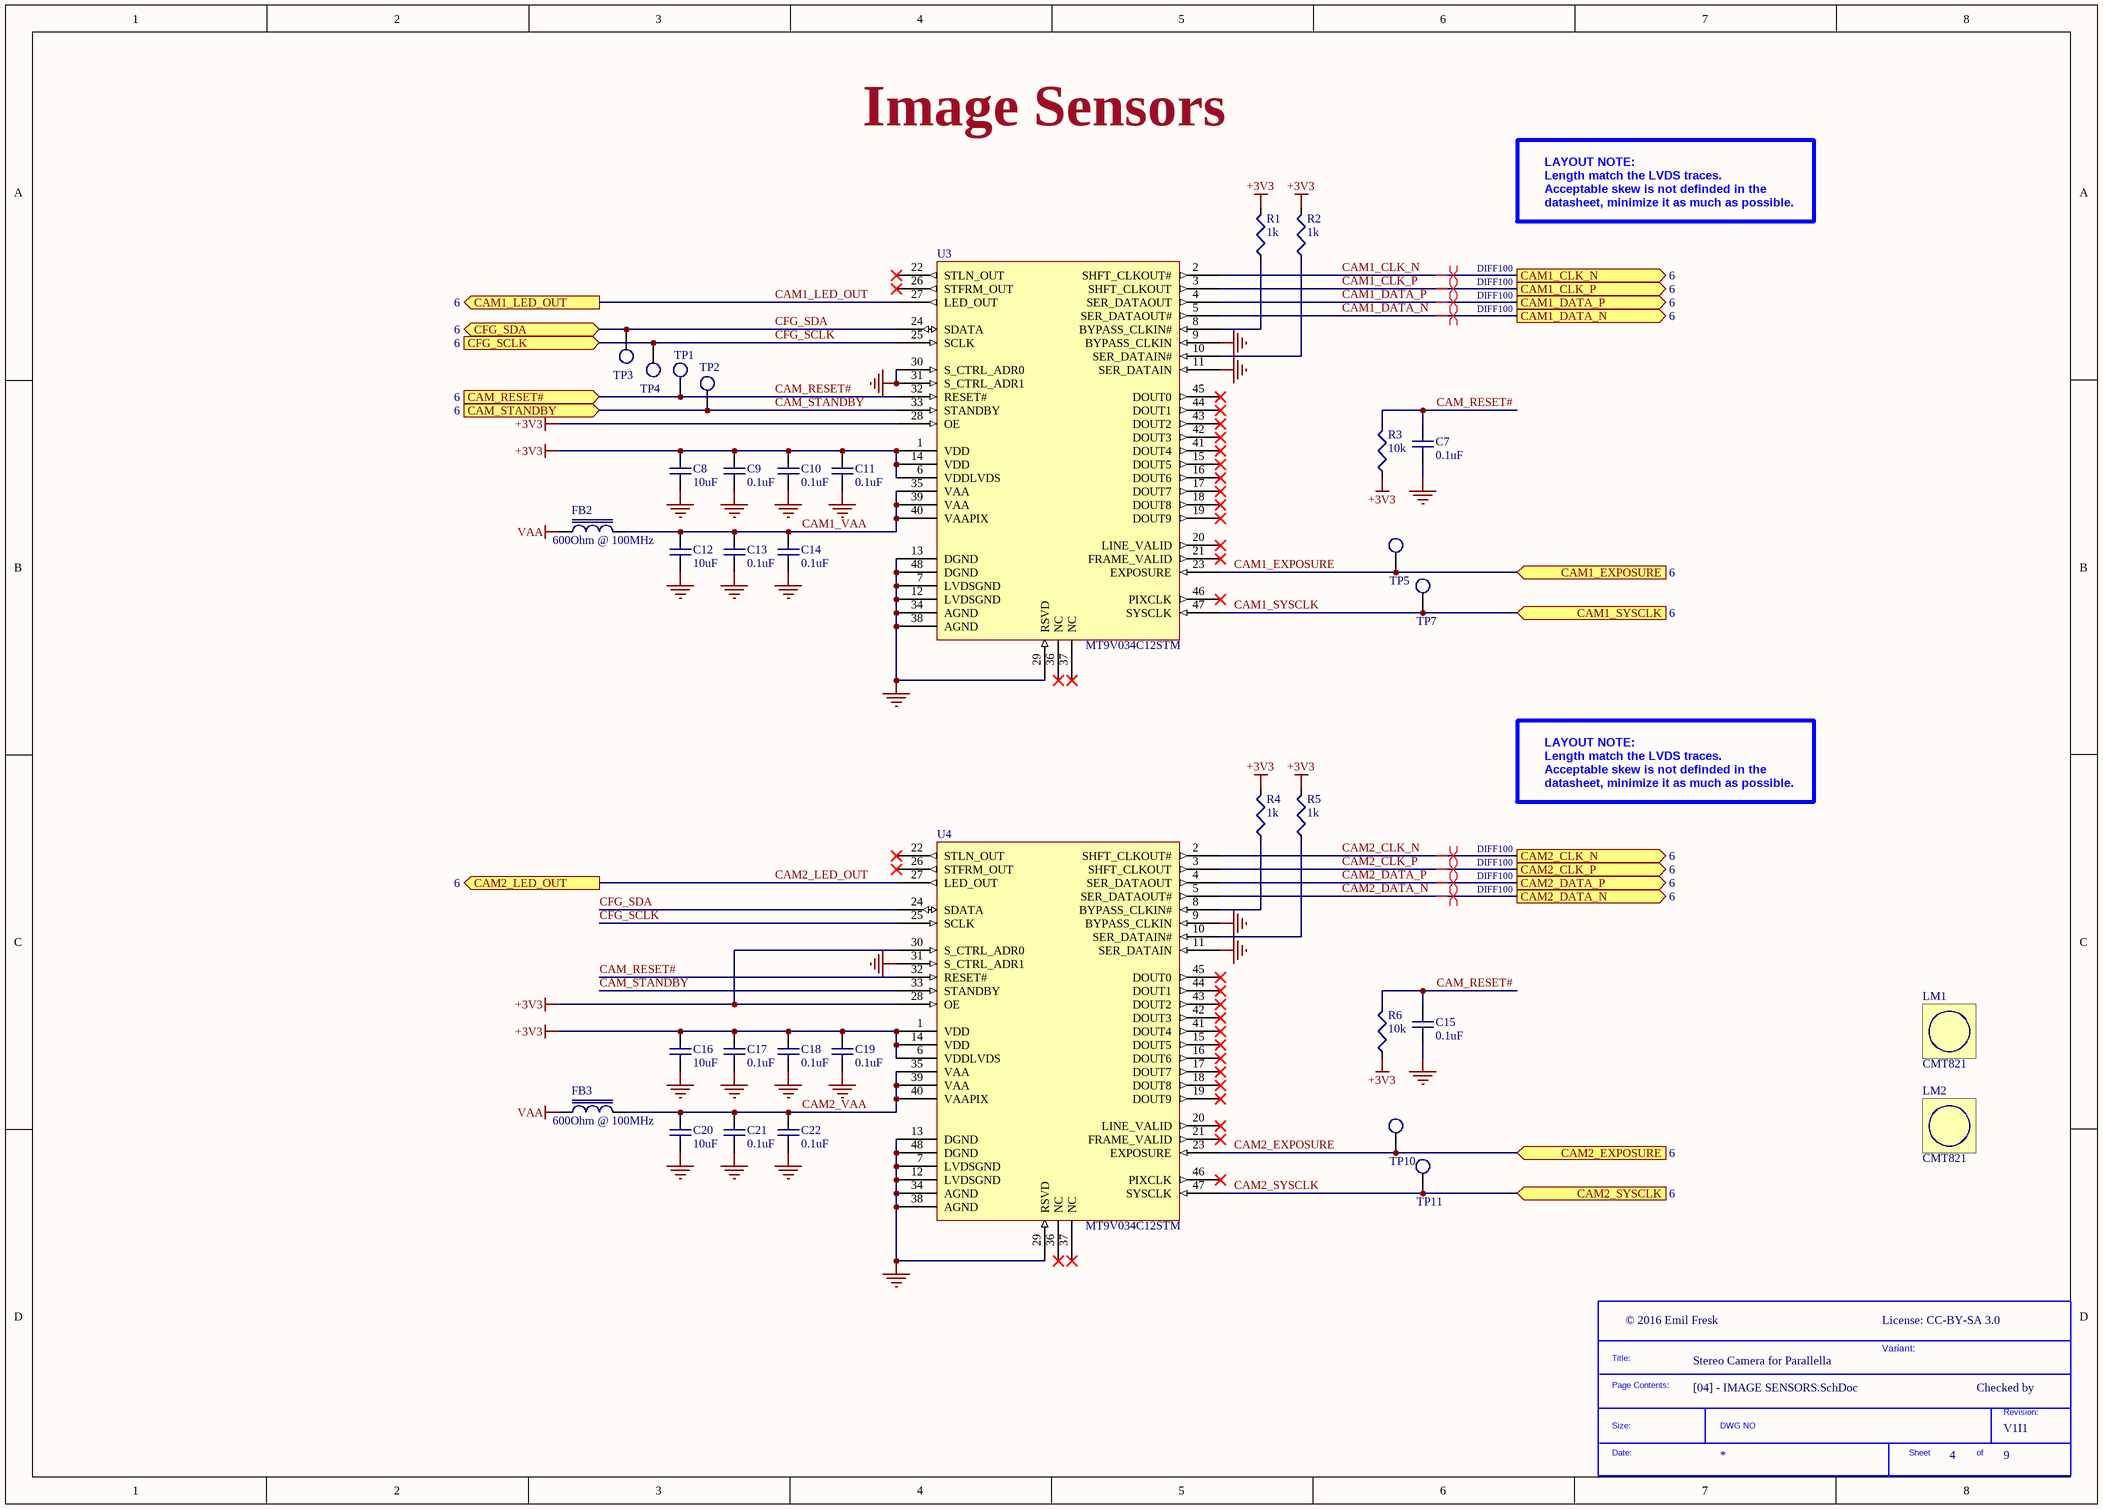
[diagram p5: [04] - IMAGE SENSORS.SchDoc]

### Parts
(Parts that share a designator on the sheet are numbered #1, #2 ... from top to bottom, then left to right.)
*#6  SDTitleBlock  (value not drawn)  (graphical)
C7  0.1uF  [C0603L]
C8  10uF  [C0603L]
C9  0.1uF  [C0603L]
C10  0.1uF  [C0603L]
C11  0.1uF  [C0603L]
C12  10uF  [C0603L]
C13  0.1uF  [C0603L]
C14  0.1uF  [C0603L]
C15  0.1uF  [C0603L]
C16  10uF  [C0603L]
C17  0.1uF  [C0603L]
C18  0.1uF  [C0603L]
C19  0.1uF  [C0603L]
C20  10uF  [C0603L]
C21  0.1uF  [C0603L]
C22  0.1uF  [C0603L]
FB2  600Ohm @ 100MHz  [R0603L]
FB3  600Ohm @ 100MHz  [R0603L]
LM1  CMT821  [CMT821 LENS HOLDER]  (no BOM)
LM2  CMT821  [CMT821 LENS HOLDER]  (no BOM)
R1  1k  [R0603L]
R2  1k  [R0603L]
R3  10k  [R0603L]
R4  1k  [R0603L]
R5  1k  [R0603L]
R6  10k  [R0603L]
TP1  TestPoint  [TestPoint_1.5mm]  (value not drawn)  (no BOM)
TP2  TestPoint  [TestPoint_1.5mm]  (value not drawn)  (no BOM)
TP3  TestPoint  [TestPoint_1.5mm]  (value not drawn)  (no BOM)
TP4  TestPoint  [TestPoint_1.5mm]  (value not drawn)  (no BOM)
TP5  TestPoint  [TestPoint_1.5mm]  (value not drawn)  (no BOM)
TP7  TestPoint  [TestPoint_1.5mm]  (value not drawn)  (no BOM)
TP10  TestPoint  [TestPoint_1.5mm]  (value not drawn)  (no BOM)
TP11  TestPoint  [TestPoint_1.5mm]  (value not drawn)  (no BOM)
U3  MT9V034C12STM  [LCC-48N_MT9V03X]
U4  MT9V034C12STM  [LCC-48N_MT9V03X]

### Ports
CAM1_CLK_N (out, see 6), CAM1_CLK_P (out, see 6), CAM1_DATA_N (out, see 6), CAM1_DATA_P (out, see 6), CAM1_EXPOSURE (in, see 6), CAM1_LED_OUT (out, see 6), CAM1_SYSCLK (in, see 6), CAM2_CLK_N (out, see 6), CAM2_CLK_P (out, see 6), CAM2_DATA_N (out, see 6), CAM2_DATA_P (out, see 6), CAM2_EXPOSURE (in, see 6), CAM2_LED_OUT (out, see 6), CAM2_SYSCLK (in, see 6), CAM_RESET# (in, see 6), CAM_STANDBY (in, see 6), CFG_SCLK (in, see 6), CFG_SDA (bidir, see 6)

### Nets
+3V3: C8.1 C9.1 C10.1 C11.1 C16.1 C17.1 C18.1 C19.1 R1.2 R2.2 R3.1 R4.2 R5.2 R6.1 U3.1(VDD) U3.6(VDDLVDS) U3.14(VDD) U3.28(OE) U4.1(VDD) U4.6(VDDLVDS) U4.14(VDD) U4.28(OE) U4.30(S_CTRL_ADR0)
GND: C7.2 C8.2 C9.2 C10.2 C11.2 C12.2 C13.2 C14.2 C15.2 C16.2 C17.2 C18.2 C19.2 C20.2 C21.2 C22.2 U3.7(LVDSGND) U3.9(BYPASS_CLKIN) U3.11(SER_DATAIN) U3.12(LVDSGND) U3.13(DGND) U3.29(RSVD) U3.30(S_CTRL_ADR0) U3.31(S_CTRL_ADR1) U3.34(AGND) U3.38(AGND) U3.48(DGND) U4.7(LVDSGND) U4.9(BYPASS_CLKIN) U4.11(SER_DATAIN) U4.12(LVDSGND) U4.13(DGND) U4.29(RSVD) U4.31(S_CTRL_ADR1) U4.34(AGND) U4.38(AGND) U4.48(DGND)
VAA: FB2.1 FB3.1
CAM1_CLK_N: U3.2(SHFT_CLKOUT#) ; port CAM1_CLK_N
CAM1_CLK_P: U3.3(SHFT_CLKOUT) ; port CAM1_CLK_P
CAM1_DATA_N: U3.5(SER_DATAOUT#) ; port CAM1_DATA_N
CAM1_DATA_P: U3.4(SER_DATAOUT) ; port CAM1_DATA_P
CAM1_EXPOSURE: TP5.1 U3.23(EXPOSURE) ; port CAM1_EXPOSURE
CAM1_LED_OUT: U3.27(LED_OUT) ; port CAM1_LED_OUT
CAM1_SYSCLK: TP7.1 U3.47(SYSCLK) ; port CAM1_SYSCLK
CAM1_VAA: C12.1 C13.1 C14.1 FB2.2 U3.35(VAA) U3.39(VAA) U3.40(VAAPIX)
CAM2_CLK_N: U4.2(SHFT_CLKOUT#) ; port CAM2_CLK_N
CAM2_CLK_P: U4.3(SHFT_CLKOUT) ; port CAM2_CLK_P
CAM2_DATA_N: U4.5(SER_DATAOUT#) ; port CAM2_DATA_N
CAM2_DATA_P: U4.4(SER_DATAOUT) ; port CAM2_DATA_P
CAM2_EXPOSURE: TP10.1 U4.23(EXPOSURE) ; port CAM2_EXPOSURE
CAM2_LED_OUT: U4.27(LED_OUT) ; port CAM2_LED_OUT
CAM2_SYSCLK: TP11.1 U4.47(SYSCLK) ; port CAM2_SYSCLK
CAM2_VAA: C20.1 C21.1 C22.1 FB3.2 U4.35(VAA) U4.39(VAA) U4.40(VAAPIX)
CAM_RESET#: C7.1 C15.1 R3.2 R6.2 TP1.1 U3.32(RESET#) U4.32(RESET#) ; port CAM_RESET#
CAM_STANDBY: TP2.1 U3.33(STANDBY) U4.33(STANDBY) ; port CAM_STANDBY
CFG_SCLK: TP4.1 U3.25(SCLK) U4.25(SCLK) ; port CFG_SCLK
CFG_SDA: TP3.1 U3.24(SDATA) U4.24(SDATA) ; port CFG_SDA
NetR1_1: R1.1 U3.8(BYPASS_CLKIN#)
NetR2_1: R2.1 U3.10(SER_DATAIN#)
NetR4_1: R4.1 U4.8(BYPASS_CLKIN#)
NetR5_1: R5.1 U4.10(SER_DATAIN#)

Not connected (* = marked no-connect by the designer): U3 15(DOUT5)* 16(DOUT6)* 17(DOUT7)* 18(DOUT8)* 19(DOUT9)* 20(LINE_VALID)* 21(FRAME_VALID)* 22(STLN_OUT)* 26(STFRM_OUT)* 36(NC)* 37(NC)* 41(DOUT4)* 42(DOUT3)* 43(DOUT2)* 44(DOUT1)* 45(DOUT0)* 46(PIXCLK)*; U4 15(DOUT5)* 16(DOUT6)* 17(DOUT7)* 18(DOUT8)* 19(DOUT9)* 20(LINE_VALID)* 21(FRAME_VALID)* 22(STLN_OUT)* 26(STFRM_OUT)* 36(NC)* 37(NC)* 41(DOUT4)* 42(DOUT3)* 43(DOUT2)* 44(DOUT1)* 45(DOUT0)* 46(PIXCLK)*

### Layout directives
differential pair; net class DIFF100: CAM1_CLK_N, CAM1_CLK_P, CAM1_DATA_N, CAM1_DATA_P, CAM2_CLK_N, CAM2_CLK_P, CAM2_DATA_N, CAM2_DATA_P

### Notes on the sheet
- Image Sensors
- LAYOUT NOTE:
  Length match the LVDS traces.
  Acceptable skew is not definded in the
  datasheet, minimize it as much as possible.
- CLOCKS (CPU & PCIE)
- Variant:
- Checked by
- (in symbol SDTitleBlock) Title:; Page Contents:; Revision:; Size:; DWG NO; Date:; Sheet; of

### Library data of the parts
C7 C9-C11 C13-C15 C17-C19 C21 C22 = GRM188R71H104KA93J: CAP CER 0.1UF 50V 10% X7R 0603; Manufacturer: Murata Electronics North America; Capacitance: 0.1µF; Supplier 1: Digi-Key; Manufacturer Part Number: GRM188R71H104KA93J; RoHS: RoHS Compliant; Category: Capacitors; Stock 1: 4487; Pricing 1: 1=0.12, 10=0.088, 50=0.048, 100=0.0405, 250=0.03316, 500=0.02838, 1000=0.02211, 5000=0.01843 (EUR); Packaging: Cut Tape (CT); Tolerance: ±10%; Voltage - Rated: 50V; Temperature Coefficient: X7R; Mounting Type: Surface Mount, MLCC; Operating Temperature: -55°C ~ 125°C; Applications: General Purpose; Ratings: -; Package / Case: 0603 (1608 Metric); Size / Dimension: 0.063" L x 0.031" W (1.60mm x 0.80mm); Height - Seated (Max): -; Thickness (Max): 0.035" (0.90mm); Lead Spacing: -; Features: -; Lead Style: -; ComponentLink1URL: http://www.murata.com/~/media/webrenewal/support/library/catalog/products/capacitor/mlcc/c02e.ashx; ComponentLink1Description: http://www.murata.com/~/media/webrenewal/support/library/catalog/products/capacitor/mlcc/c02e.ashx; Supplier Part Number 1: 490-9735-1-ND
C8 C12 C16 C20 = GRM188R61C106MA73D: as C1 on sheet [03] - POWER; Supplier 1: Digi-Key; Manufacturer Part Number: GRM188R61C106MA73D; RoHS: RoHS Compliant; Category: Capacitors; Stock 1: 1868; Pricing 1: 1=0.18, 10=0.171, 25=0.146, 50=0.1242, 100=0.1195, 250=0.10728, 500=0.10238, 1000=0.08532 (EUR); Packaging: Cut Tape (CT); Tolerance: ±20%; Voltage - Rated: 16V; Temperature Coefficient: X5R; Mounting Type: Surface Mount, MLCC; Operating Temperature: -55°C ~ 85°C; Applications: General Purpose; Ratings: -; Package / Case: 0603 (1608 Metric); Size / Dimension: 0.063" L x 0.031" W (1.60mm x 0.80mm); Height - Seated (Max): -; Thickness (Max): 0.031" (0.80mm); Lead Spacing: -; Features: -; Lead Style: -; ComponentLink1URL: http://www.murata.com/~/media/webrenewal/support/library/catalog/products/capacitor/mlcc/c02e.ashx; ComponentLink1Description: http://www.murata.com/~/media/webrenewal/support/library/catalog/products/capacitor/mlcc/c02e.ashx; Supplier Part Number 1: 490-7201-1-ND
FB2 FB3 = MPZ1608S601ATA00: as FB1 on sheet [03] - POWER; Supplier 1: Digi-Key; Manufacturer Part Number: MPZ1608S601ATA00; RoHS: RoHS Compliant; Category: Filters; Stock 1: 108962; Pricing 1: 1=0.09, 10=0.07, 100=0.0415, 250=0.0302, 500=0.02768, 1000=0.02391 (EUR); Packaging: Cut Tape (CT); Impedance @ Frequency: 600 Ohm @ 100MHz; Package / Case: 0603 (1608 Metric); Mounting Type: Surface Mount; Height (Max): 0.037" (0.95mm); Size / Dimension: 0.063" L x 0.031" W (1.60mm x 0.80mm); ComponentLink1URL: http://product.tdk.com/en/catalog/datasheets/beads_commercial_power_mpz_en.pdf; ComponentLink1Description: http://product.tdk.com/en/catalog/datasheets/beads_commercial_power_mpz_en.pdf; Supplier Part Number 1: 445-2205-1-ND
LM1 LM2 = CMT821 LENS MOUNT
R1 R2 R4 R5 = CRCW06031K00FKEA: RES SMD 1K OHM 1% 1/10W 0603; Manufacturer: Vishay Dale; Power (Watts): 0.1W, 1/10W; Temperature Coefficient: ±100ppm/°C; Supplier 1: Digi-Key; Manufacturer Part Number: CRCW06031K00FKEA; RoHS: RoHS Compliant; Category: Resistors; Stock 1: 831888; Pricing 1: 10=0.077, 50=0.0416, 200=0.02385, 1000=0.01628 (EUR); Packaging: Cut Tape (CT); Resistance (Ohms): 1k; Tolerance: ±1%; Composition: Thick Film; Features: Automotive AEC-Q200; Operating Temperature: -55°C ~ 155°C; Package / Case: 0603 (1608 Metric); Supplier Device Package: 0603 (1608 Metric); Size / Dimension: 0.061" L x 0.033" W (1.55mm x 0.85mm); Height: 0.020" (0.50mm); Number of Terminations: 2; ComponentLink1URL: http://www.vishay.com/docs/20035/dcrcwe3.pdf; ComponentLink1Description: http://www.vishay.com/docs/20035/dcrcwe3.pdf; Supplier Part Number 1: 541-1.00KHCT-ND
R3 R6 = CRCW060310K0FKEA: RES SMD 10K OHM 1% 1/10W 0603; Manufacturer: Vishay Dale; Power (Watts): 0.1W, 1/10W; Temperature Coefficient: ±100ppm/°C; Supplier 1: Digi-Key; Manufacturer Part Number: CRCW060310K0FKEA; RoHS: RoHS Compliant; Category: Resistors; Stock 1: 2971108; Pricing 1: 10=0.077, 50=0.0416, 200=0.02385, 1000=0.01628 (EUR); Packaging: Cut Tape (CT); Resistance (Ohms): 10k; Tolerance: ±1%; Composition: Thick Film; Features: Automotive AEC-Q200; Operating Temperature: -55°C ~ 155°C; Package / Case: 0603 (1608 Metric); Supplier Device Package: 0603 (1608 Metric); Size / Dimension: 0.061" L x 0.033" W (1.55mm x 0.85mm); Height: 0.020" (0.50mm); Number of Terminations: 2; ComponentLink1URL: http://www.vishay.com/docs/20035/dcrcwe3.pdf; ComponentLink1Description: http://www.vishay.com/docs/20035/dcrcwe3.pdf; Supplier Part Number 1: 541-10.0KHCT-ND
U3 U4 = MT9V034C12STM: SENSOR IMAGE VGA MONO 48-CLCC; Manufacturer: Aptina LLC; Pixel Size: 6µm x 6µm; Active Pixel Array: 752H x 480V; Frames per Second: 60; Voltage - Supply: 3.3V; Supplier 1: Digi-Key; Manufacturer Part Number: MT9V034C12STM; RoHS: RoHS Compliant; Category: Sensors, Transducers; Stock 1: 0; Pricing 1: 152=12.75178 (EUR); Packaging: Tray; Type: CMOS Imaging; Package / Case: 48-CLCC; Supplier Device Package: 48-CLCC; Note: *; ComponentLink1URL: http://media.digikey.com/pdf/Data%20Sheets/APTINA%20PDFs/MT9V034.pdf; ComponentLink1Description: http://media.digikey.com/pdf/Data%20Sheets/APTINA%20PDFs/MT9V034.pdf; Supplier Part Number 1: 557-1454-ND

## Sheet [05] - IMU.SchDoc
size A3; DocumentNumber: 5; SheetNumber: 5; SheetTotal: 9
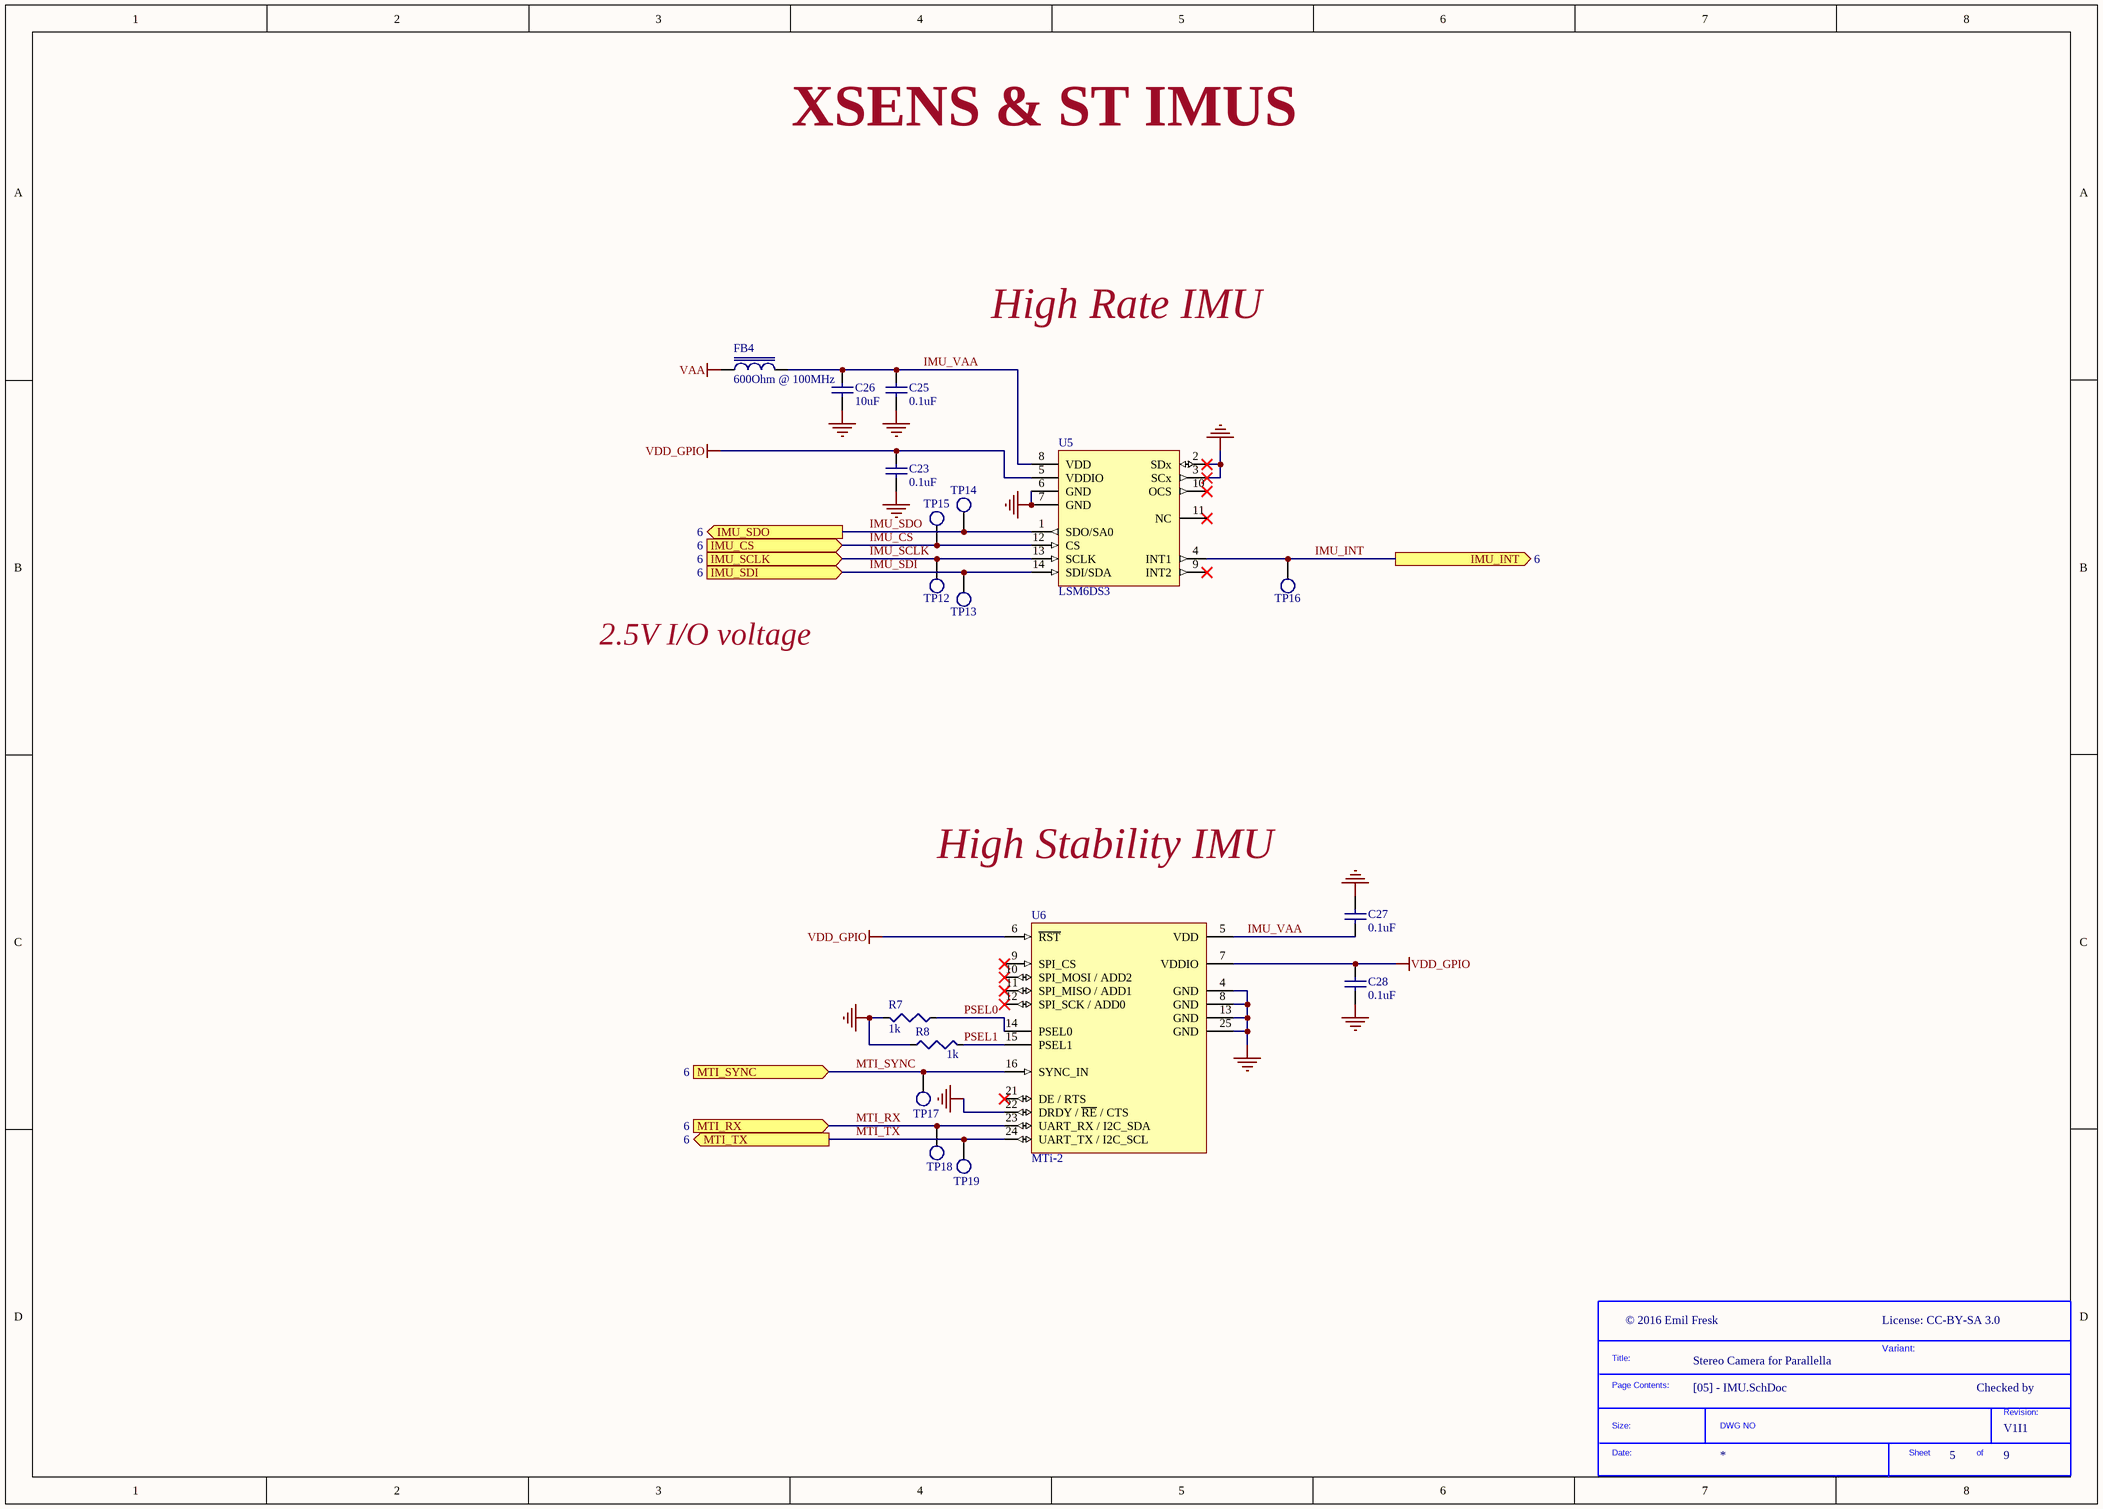
[diagram p6: [05] - IMU.SchDoc]

### Parts
(Parts that share a designator on the sheet are numbered #1, #2 ... from top to bottom, then left to right.)
*#7  SDTitleBlock  (value not drawn)  (graphical)
C23  0.1uF  [C0603L]
C25  0.1uF  [C0603L]
C26  10uF  [C0603L]
C27  0.1uF  [C0603L]
C28  0.1uF  [C0603L]
FB4  600Ohm @ 100MHz  [R0603L]
R7  1k  [R0603L]
R8  1k  [R0603L]
TP12  TestPoint  [TestPoint_1.5mm]  (value not drawn)  (no BOM)
TP13  TestPoint  [TestPoint_1.5mm]  (value not drawn)  (no BOM)
TP14  TestPoint  [TestPoint_1.5mm]  (value not drawn)  (no BOM)
TP15  TestPoint  [TestPoint_1.5mm]  (value not drawn)  (no BOM)
TP16  TestPoint  [TestPoint_1.5mm]  (value not drawn)  (no BOM)
TP17  TestPoint  [TestPoint_1.5mm]  (value not drawn)  (no BOM)
TP18  TestPoint  [TestPoint_1.5mm]  (value not drawn)  (no BOM)
TP19  TestPoint  [TestPoint_1.5mm]  (value not drawn)  (no BOM)
U5  LSM6DS3  [LGA14-N]
U6  MTi-2  [MTi-1]

### Ports
IMU_CS (in, see 6), IMU_INT (out, see 6), IMU_SCLK (in, see 6), IMU_SDI (in, see 6), IMU_SDO (out, see 6), MTI_RX (in, see 6), MTI_SYNC (in, see 6), MTI_TX (out, see 6)

### Nets
GND: C23.2 C25.2 C26.2 C27.1 C28.2 R7.2 R8.1 U5.2(SDx) U5.3(SCx) U5.6(GND) U5.7(GND) U6.4(GND) U6.8(GND) U6.13(GND) U6.22(DRDY_/_~{RE}_/_CTS) U6.25(GND)
VAA: FB4.1
VDD_GPIO: C23.1 C28.1 U5.5(VDDIO) U6.6(~{RST}) U6.7(VDDIO)
IMU_CS: TP15.1 U5.12(CS) ; port IMU_CS
IMU_INT: TP16.1 U5.4(INT1) ; port IMU_INT
IMU_SCLK: TP12.1 U5.13(SCLK) ; port IMU_SCLK
IMU_SDI: TP13.1 U5.14(SDI/SDA) ; port IMU_SDI
IMU_SDO: TP14.1 U5.1(SDO/SA0) ; port IMU_SDO
IMU_VAA: C25.1 C26.1 C27.2 FB4.2 U5.8(VDD) U6.5(VDD)
MTI_RX: TP18.1 U6.23(UART_RX_/_I2C_SDA) ; port MTI_RX
MTI_SYNC: TP17.1 U6.16(SYNC_IN) ; port MTI_SYNC
MTI_TX: TP19.1 U6.24(UART_TX_/_I2C_SCL) ; port MTI_TX
PSEL0: R7.1 U6.14(PSEL0)
PSEL1: R8.2 U6.15(PSEL1)

Not connected (* = marked no-connect by the designer): U5 9(INT2)* 10(OCS)* 11(NC)*; U6 9(SPI_CS)* 10(SPI_MOSI_/_ADD2)* 11(SPI_MISO_/_ADD1)* 12(SPI_SCK_/_ADD0)* 21(DE_/_RTS)*

### Notes on the sheet
- XSENS & ST IMUS
- High Rate IMU
- 2.5V I/O voltage
- High Stability IMU
- CLOCKS (CPU & PCIE)
- Variant:
- Checked by
- (in symbol SDTitleBlock) Title:; Page Contents:; Revision:; Size:; DWG NO; Date:; Sheet; of

### Library data of the parts
C23 C25 C27 C28 = GRM188R71H104KA93J: as C7 on sheet [04] - IMAGE SENSORS; Supplier 1: Digi-Key; Manufacturer Part Number: GRM188R71H104KA93J; RoHS: RoHS Compliant; Category: Capacitors; Stock 1: 4487; Pricing 1: 1=0.12, 10=0.088, 50=0.048, 100=0.0405, 250=0.03316, 500=0.02838, 1000=0.02211, 5000=0.01843 (EUR); Packaging: Cut Tape (CT); Tolerance: ±10%; Voltage - Rated: 50V; Temperature Coefficient: X7R; Mounting Type: Surface Mount, MLCC; Operating Temperature: -55°C ~ 125°C; Applications: General Purpose; Ratings: -; Package / Case: 0603 (1608 Metric); Size / Dimension: 0.063" L x 0.031" W (1.60mm x 0.80mm); Height - Seated (Max): -; Thickness (Max): 0.035" (0.90mm); Lead Spacing: -; Features: -; Lead Style: -; ComponentLink1URL: http://www.murata.com/~/media/webrenewal/support/library/catalog/products/capacitor/mlcc/c02e.ashx; ComponentLink1Description: http://www.murata.com/~/media/webrenewal/support/library/catalog/products/capacitor/mlcc/c02e.ashx; Supplier Part Number 1: 490-9735-1-ND
C26 = GRM188R61C106MA73D: as C1 on sheet [03] - POWER; Supplier 1: Digi-Key; Manufacturer Part Number: GRM188R61C106MA73D; RoHS: RoHS Compliant; Category: Capacitors; Stock 1: 1868; Pricing 1: 1=0.18, 10=0.171, 25=0.146, 50=0.1242, 100=0.1195, 250=0.10728, 500=0.10238, 1000=0.08532 (EUR); Packaging: Cut Tape (CT); Tolerance: ±20%; Voltage - Rated: 16V; Temperature Coefficient: X5R; Mounting Type: Surface Mount, MLCC; Operating Temperature: -55°C ~ 85°C; Applications: General Purpose; Ratings: -; Package / Case: 0603 (1608 Metric); Size / Dimension: 0.063" L x 0.031" W (1.60mm x 0.80mm); Height - Seated (Max): -; Thickness (Max): 0.031" (0.80mm); Lead Spacing: -; Features: -; Lead Style: -; ComponentLink1URL: http://www.murata.com/~/media/webrenewal/support/library/catalog/products/capacitor/mlcc/c02e.ashx; ComponentLink1Description: http://www.murata.com/~/media/webrenewal/support/library/catalog/products/capacitor/mlcc/c02e.ashx; Supplier Part Number 1: 490-7201-1-ND
FB4 = MPZ1608S601ATA00: as FB1 on sheet [03] - POWER; Supplier 1: Digi-Key; Manufacturer Part Number: MPZ1608S601ATA00; RoHS: RoHS Compliant; Category: Filters; Stock 1: 108962; Pricing 1: 1=0.09, 10=0.07, 100=0.0415, 250=0.0302, 500=0.02768, 1000=0.02391 (EUR); Packaging: Cut Tape (CT); Impedance @ Frequency: 600 Ohm @ 100MHz; Package / Case: 0603 (1608 Metric); Mounting Type: Surface Mount; Height (Max): 0.037" (0.95mm); Size / Dimension: 0.063" L x 0.031" W (1.60mm x 0.80mm); ComponentLink1URL: http://product.tdk.com/en/catalog/datasheets/beads_commercial_power_mpz_en.pdf; ComponentLink1Description: http://product.tdk.com/en/catalog/datasheets/beads_commercial_power_mpz_en.pdf; Supplier Part Number 1: 445-2205-1-ND
R7 R8 = CRCW06031K00FKEA: as R1 on sheet [04] - IMAGE SENSORS; Supplier 1: Digi-Key; Manufacturer Part Number: CRCW06031K00FKEA; RoHS: RoHS Compliant; Category: Resistors; Stock 1: 831888; Pricing 1: 10=0.077, 50=0.0416, 200=0.02385, 1000=0.01628 (EUR); Packaging: Cut Tape (CT); Resistance (Ohms): 1k; Tolerance: ±1%; Composition: Thick Film; Features: Automotive AEC-Q200; Operating Temperature: -55°C ~ 155°C; Package / Case: 0603 (1608 Metric); Supplier Device Package: 0603 (1608 Metric); Size / Dimension: 0.061" L x 0.033" W (1.55mm x 0.85mm); Height: 0.020" (0.50mm); Number of Terminations: 2; ComponentLink1URL: http://www.vishay.com/docs/20035/dcrcwe3.pdf; ComponentLink1Description: http://www.vishay.com/docs/20035/dcrcwe3.pdf; Supplier Part Number 1: 541-1.00KHCT-ND
U5 = LSM6DS3TR: IC MOD 3D ACC/GYRO INEMO 14VFLGA; Manufacturer: STMicroelectronics; Sensor Type: Accelerometer, Gyroscope, 3 Axis; Output Type: I²C, SPI; Supplier 1: Digi-Key; Manufacturer Part Number: LSM6DS3TR; RoHS: RoHS Compliant; Category: Sensors, Transducers; Stock 1: 1809; Pricing 1: 1=3.74, 10=3.01, 100=2.6774, 250=2.4674, 500=2.2224, 1000=1.87241, 2500=1.77617 (EUR); ComponentLink1URL: http://www.st.com/web/en/resource/technical/document/datasheet/DM00133076.pdf; ComponentLink1Description: http://www.st.com/web/en/resource/technical/document/datasheet/DM00133076.pdf; Supplier Part Number 1: 497-15383-1-ND
U6 = MTi-1

## Sheet [06] - CONNECTORS 1.SchDoc
size A3; DocumentNumber: 6; SheetNumber: 6; SheetTotal: 9
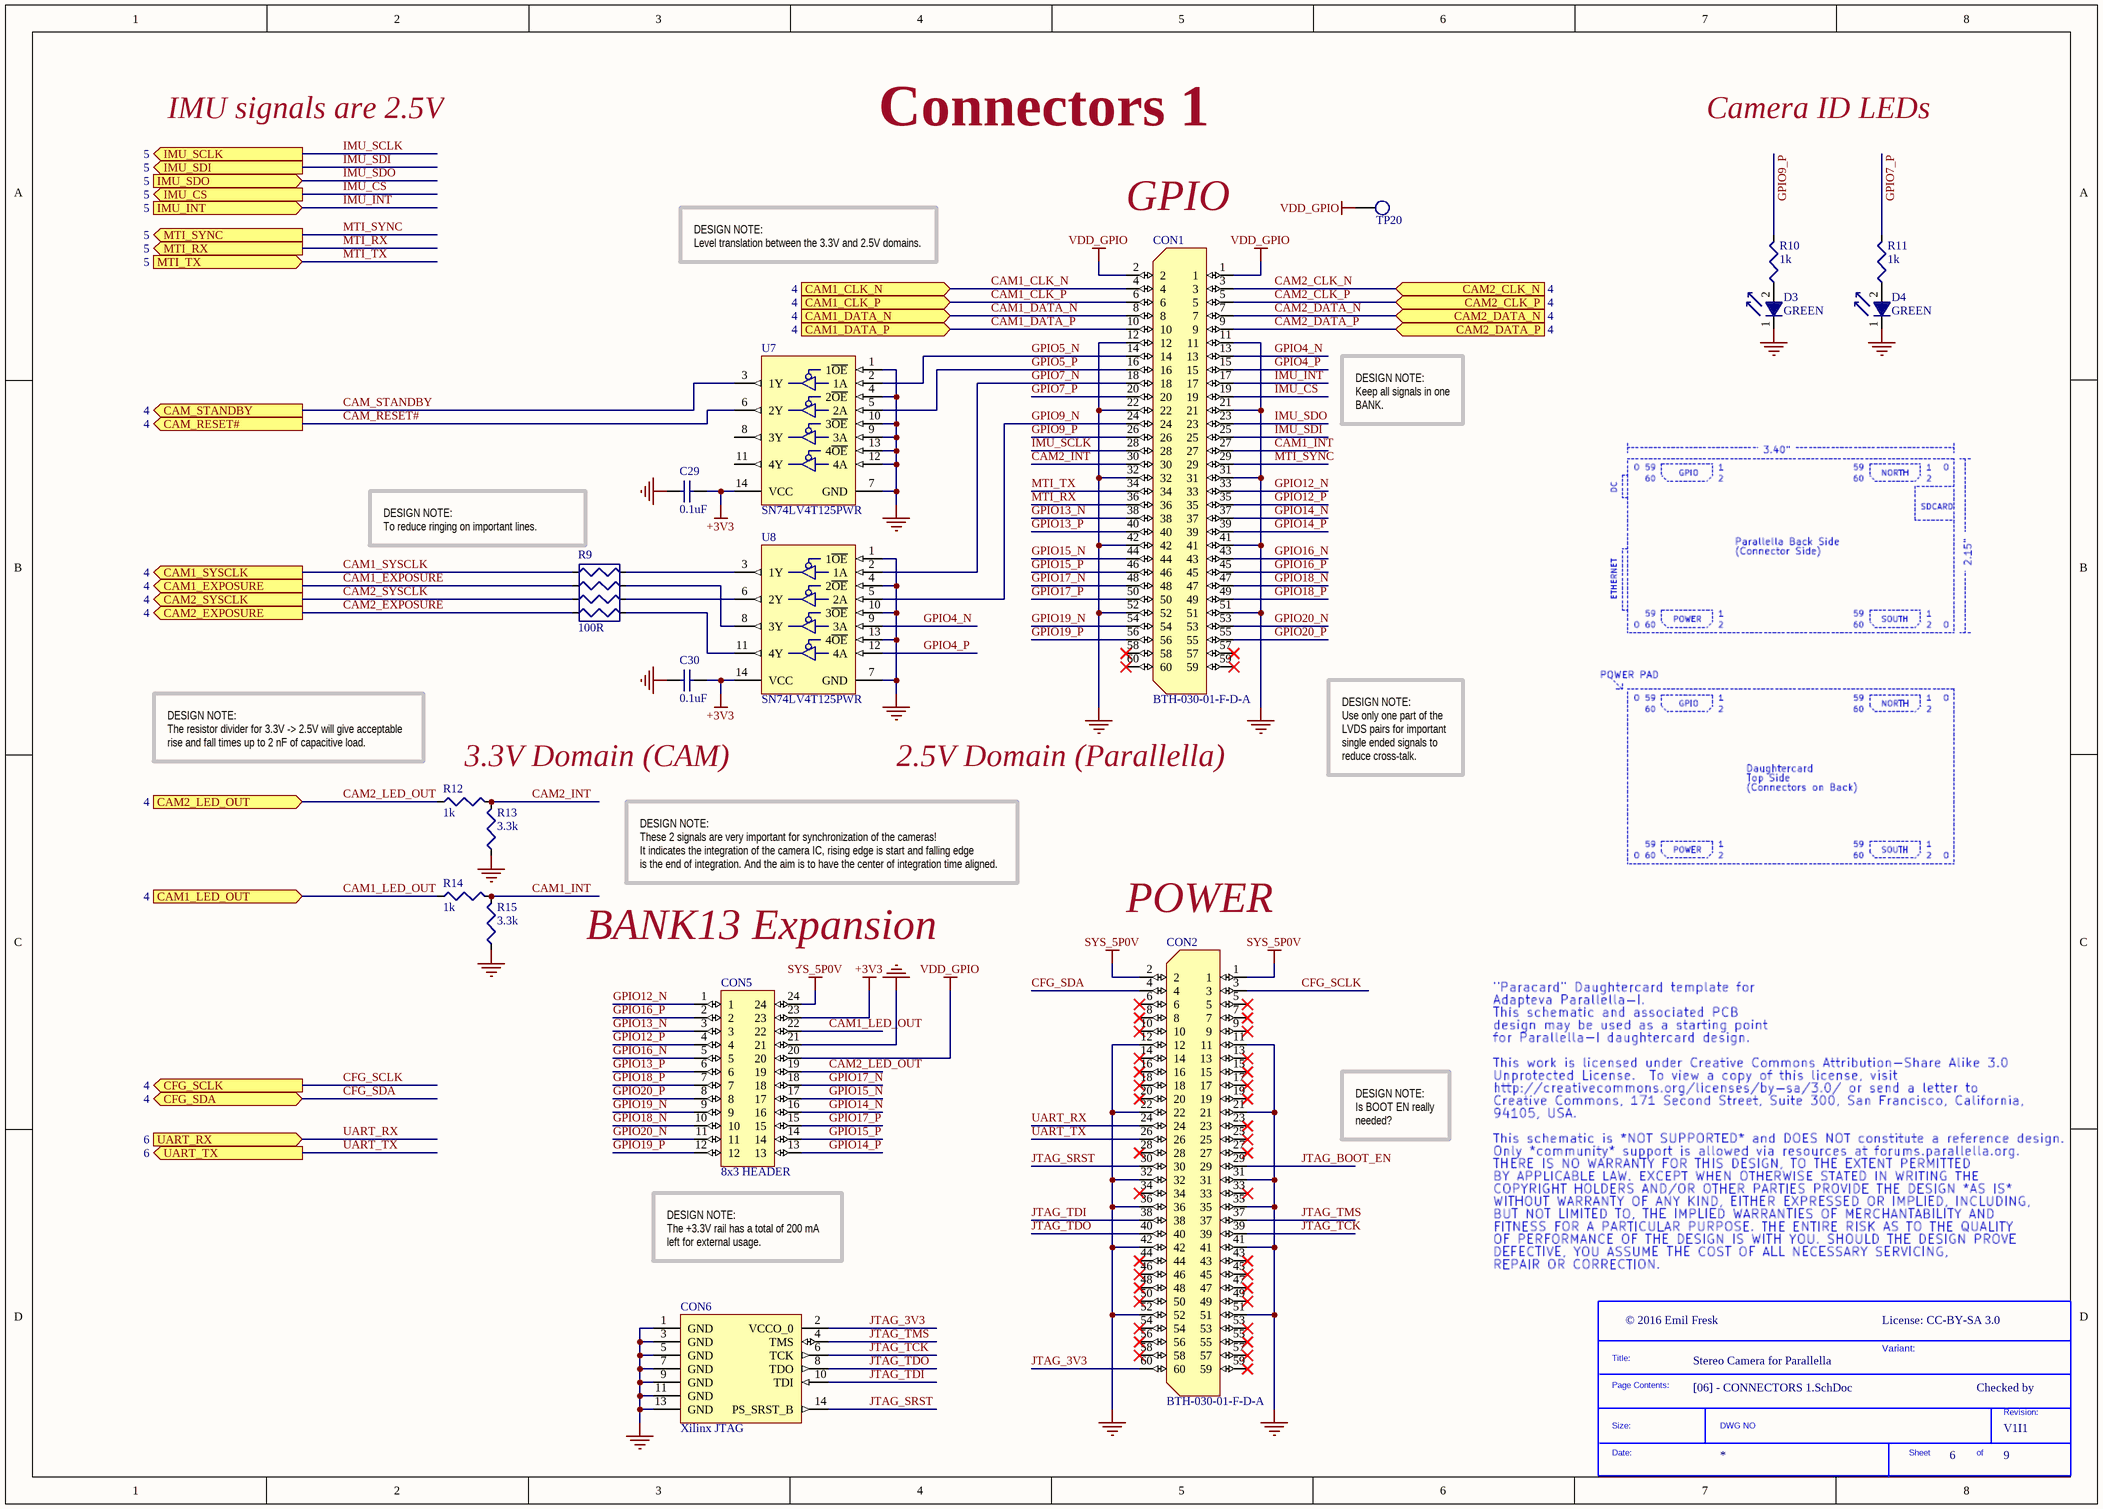
[diagram p7: [06] - CONNECTORS 1.SchDoc]

### Parts
(Parts that share a designator on the sheet are numbered #1, #2 ... from top to bottom, then left to right.)
*#8  SDTitleBlock  (value not drawn)  (graphical)
C29  0.1uF  [C0603L]
C30  0.1uF  [C0603L]
CON1  BTH-030-01-F-D-A  [BTH-030-01-X-D-A-K]
CON2  BTH-030-01-F-D-A  [BTH-030-01-X-D-A-K]
CON5  8x3 HEADER  [8x3HEADER_2.54mm]
CON6  Xilinx JTAG  [Xilinx JTAG Header]
D3  GREEN  [LED0603_GREEN]
D4  GREEN  [LED0603_GREEN]
R9  100R  [CAC-80P319X159-8L]
R10  1k  [R0603L]
R11  1k  [R0603L]
R12  1k  [R0603L]
R13  3.3k  [R0603L]
R14  1k  [R0603L]
R15  3.3k  [R0603L]
TP20  TestPoint  [TestPoint_1.5mm]  (value not drawn)  (no BOM)
U7  SN74LV4T125PWR  [TSSOP14N]
U8  SN74LV4T125PWR  [TSSOP14N]

### Ports
CAM1_CLK_N (in, see 4), CAM1_CLK_P (in, see 4), CAM1_DATA_N (in, see 4), CAM1_DATA_P (in, see 4), CAM1_EXPOSURE (out, see 4), CAM1_LED_OUT (in, see 4), CAM1_SYSCLK (out, see 4), CAM2_CLK_N (in, see 4), CAM2_CLK_P (in, see 4), CAM2_DATA_N (in, see 4), CAM2_DATA_P (in, see 4), CAM2_EXPOSURE (out, see 4), CAM2_LED_OUT (in, see 4), CAM2_SYSCLK (out, see 4), CAM_RESET# (out, see 4), CAM_STANDBY (out, see 4), CFG_SCLK (out, see 4), CFG_SDA (bidir, see 4), IMU_CS (out, see 5), IMU_INT (in, see 5), IMU_SCLK (out, see 5), IMU_SDI (out, see 5), IMU_SDO (in, see 5), MTI_RX (out, see 5), MTI_SYNC (out, see 5), MTI_TX (in, see 5), UART_RX (in, see 6), UART_TX (out, see 6)

### Nets
+3V3: C29.2 C30.2 CON5.23 U7.14(VCC) U8.14(VCC)
GND: C29.1 C30.1 CON1.11 CON1.12 CON1.21 CON1.22 CON1.31 CON1.32 CON1.41 CON1.42 CON1.51 CON1.52 CON2.11 CON2.12 CON2.21 CON2.22 CON2.31 CON2.32 CON2.35 CON2.36 CON2.41 CON2.42 CON2.51 CON2.52 CON5.21 CON6.1(GND) CON6.3(GND) CON6.5(GND) CON6.7(GND) CON6.9(GND) CON6.11(GND) CON6.13(GND) D3.1 D4.1 R13.1 R15.1 U7.1(1~{OE}) U7.4(2~{OE}) U7.7(GND) U7.9(3A) U7.10(3~{OE}) U7.12(4A) U7.13(4~{OE}) U8.1(1~{OE}) U8.4(2~{OE}) U8.7(GND) U8.10(3~{OE}) U8.13(4~{OE})
SYS_5P0V: CON2.1 CON2.2 CON5.24
VDD_GPIO: CON1.1 CON1.2 CON5.20 TP20.1
CAM1_CLK_N: CON1.4 ; port CAM1_CLK_N
CAM1_CLK_P: CON1.6 ; port CAM1_CLK_P
CAM1_DATA_N: CON1.8 ; port CAM1_DATA_N
CAM1_DATA_P: CON1.10 ; port CAM1_DATA_P
CAM1_EXPOSURE: R9.2 ; port CAM1_EXPOSURE
CAM1_INT: CON1.27 R14.2 R15.2
CAM1_LED_OUT: CON5.22 R14.1 ; port CAM1_LED_OUT
CAM1_SYSCLK: R9.1 ; port CAM1_SYSCLK
CAM2_CLK_N: CON1.3 ; port CAM2_CLK_N
CAM2_CLK_P: CON1.5 ; port CAM2_CLK_P
CAM2_DATA_N: CON1.7 ; port CAM2_DATA_N
CAM2_DATA_P: CON1.9 ; port CAM2_DATA_P
CAM2_EXPOSURE: R9.4 ; port CAM2_EXPOSURE
CAM2_INT: CON1.30 R12.2 R13.2
CAM2_LED_OUT: CON5.19 R12.1 ; port CAM2_LED_OUT
CAM2_SYSCLK: R9.3 ; port CAM2_SYSCLK
CAM_RESET#: U7.6(2Y) ; port CAM_RESET#
CAM_STANDBY: U7.3(1Y) ; port CAM_STANDBY
CFG_SCLK: CON2.3 ; port CFG_SCLK
CFG_SDA: CON2.4 ; port CFG_SDA
GPIO4_N: CON1.13 U8.9(3A)
GPIO4_P: CON1.15 U8.12(4A)
GPIO5_N: CON1.14 U7.2(1A)
GPIO5_P: CON1.16 U7.5(2A)
GPIO7_N: CON1.18 U8.2(1A)
GPIO7_P: CON1.20 R11.2
GPIO9_N: CON1.24 U8.5(2A)
GPIO9_P: CON1.26 R10.2
GPIO12_N: CON1.33 CON5.1
GPIO12_P: CON1.35 CON5.4
GPIO13_N: CON1.38 CON5.3
GPIO13_P: CON1.40 CON5.6
GPIO14_N: CON1.37 CON5.16
GPIO14_P: CON1.39 CON5.13
GPIO15_N: CON1.44 CON5.17
GPIO15_P: CON1.46 CON5.14
GPIO16_N: CON1.43 CON5.5
GPIO16_P: CON1.45 CON5.2
GPIO17_N: CON1.48 CON5.18
GPIO17_P: CON1.50 CON5.15
GPIO18_N: CON1.47 CON5.10
GPIO18_P: CON1.49 CON5.7
GPIO19_N: CON1.54 CON5.9
GPIO19_P: CON1.56 CON5.12
GPIO20_N: CON1.53 CON5.11
GPIO20_P: CON1.55 CON5.8
IMU_CS: CON1.19 ; port IMU_CS
IMU_INT: CON1.17 ; port IMU_INT
IMU_SCLK: CON1.28 ; port IMU_SCLK
IMU_SDI: CON1.25 ; port IMU_SDI
IMU_SDO: CON1.23 ; port IMU_SDO
JTAG_3V3: CON2.60 CON6.2(VCCO_0)
JTAG_BOOT_EN: CON2.29
JTAG_SRST: CON2.30 CON6.14(PS_SRST_B)
JTAG_TCK: CON2.39 CON6.6(TCK)
JTAG_TDI: CON2.38 CON6.10(TDI)
JTAG_TDO: CON2.40 CON6.8(TDO)
JTAG_TMS: CON2.37 CON6.4(TMS)
MTI_RX: CON1.36 ; port MTI_RX
MTI_SYNC: CON1.29 ; port MTI_SYNC
MTI_TX: CON1.34 ; port MTI_TX
UART_RX: CON2.24 ; port UART_RX
UART_TX: CON2.26 ; port UART_TX
NetD3_2: D3.2 R10.1
NetD4_2: D4.2 R11.1
NetR9_5: R9.5 U8.11(4Y)
NetR9_6: R9.6 U8.6(2Y)
NetR9_7: R9.7 U8.8(3Y)
NetR9_8: R9.8 U8.3(1Y)

Not connected (* = marked no-connect by the designer): CON1 57* 58* 59* 60*; CON2 5* 6* 7* 8* 9* 10* 13* 14* 15* 16* 17* 18* 19* 20* 23* 25* 27* 28* 33* 34* 43* 44* 45* 46* 47* 48* 49* 50* 53* 54* 55* 56* 57* 58* 59*; U7 8(3Y) 11(4Y)

### Notes on the sheet
- IMU signals are 2.5V
- Connectors 1
- Camera ID LEDs
- DESIGN NOTE:
  Level translation between the 3.3V and 2.5V domains.
- GPIO
- DESIGN NOTE:
  Keep all signals in one BANK.
- (near R9) DESIGN NOTE:
  To reduce ringing on important lines.
- DESIGN NOTE:
  The resistor divider for 3.3V -> 2.5V will give acceptable rise and fall times up to 2 nF of capacitive load.
- 3.3V Domain (CAM)
- 2.5V Domain (Parallella)
- DESIGN NOTE:
  Use only one part of the
  LVDS pairs for important
  single ended signals to
  reduce cross-talk.
- DESIGN NOTE:
  These 2 signals are very important for synchronization of the cameras!
  It indicates the integration of the camera IC, rising edge is start and falling edge
  is the end of integration. And the aim is to have the center of integration time aligned.
- POWER
- BANK13 Expansion
- DESIGN NOTE:
  Is BOOT EN really needed?
- DESIGN NOTE:
  The +3.3V rail has a total of 200 mA left for external usage.
- CLOCKS (CPU & PCIE)
- Variant:
- Checked by
- (in symbol SDTitleBlock) Title:; Page Contents:; Revision:; Size:; DWG NO; Date:; Sheet; of

### Library data of the parts
C29 C30 = GRM188R71H104KA93J: as C7 on sheet [04] - IMAGE SENSORS; Supplier 1: Digi-Key; Manufacturer Part Number: GRM188R71H104KA93J; RoHS: RoHS Compliant; Category: Capacitors; Stock 1: 4487; Pricing 1: 1=0.12, 10=0.088, 50=0.048, 100=0.0405, 250=0.03316, 500=0.02838, 1000=0.02211, 5000=0.01843 (EUR); Packaging: Cut Tape (CT); Tolerance: ±10%; Voltage - Rated: 50V; Temperature Coefficient: X7R; Mounting Type: Surface Mount, MLCC; Operating Temperature: -55°C ~ 125°C; Applications: General Purpose; Ratings: -; Package / Case: 0603 (1608 Metric); Size / Dimension: 0.063" L x 0.031" W (1.60mm x 0.80mm); Height - Seated (Max): -; Thickness (Max): 0.035" (0.90mm); Lead Spacing: -; Features: -; Lead Style: -; ComponentLink1URL: http://www.murata.com/~/media/webrenewal/support/library/catalog/products/capacitor/mlcc/c02e.ashx; ComponentLink1Description: http://www.murata.com/~/media/webrenewal/support/library/catalog/products/capacitor/mlcc/c02e.ashx; Supplier Part Number 1: 490-9735-1-ND
CON1 CON2 = BTH-030-01-F-D-A: CONN RCPT 60POS 0.5MM SMD; Manufacturer: Samtec Inc; Connector Type: Socket, Center Strip Contacts; Number of Positions: 60; Pitch: 0.020" (0.50mm); Mated Stacking Heights: 5mm; Supplier 1: Digi-Key; Manufacturer Part Number: BTH-030-01-F-D-A; RoHS: RoHS Compliant; Category: Connectors, Interconnects; Stock 1: 0; Pricing 1: 1=5.93 (EUR); Packaging: Tray; Number of Rows: 2; Mounting Type: Surface Mount; Features: Board Guide; Contact Finish: Gold; Contact Finish Thickness: Flash; Height Above Board: 0.128" (3.25mm); ComponentLink1URL: http://www.samtec.com/ftppub/cpdf/BSH-XXX-01-X-D-XX-XX-MKT.pdf; ComponentLink1Description: http://www.samtec.com/ftppub/cpdf/BSH-XXX-01-X-D-XX-XX-MKT.pdf; Supplier Part Number 1: BTH-030-01-F-D-A-ND
D3 D4 = LTST-C190KGKT: LED GREEN CLEAR 0603 SMD; Manufacturer: Lite-On Inc; Wavelength - Dominant: 571nm; Wavelength - Peak: 574nm; Millicandela Rating: 35mcd; Voltage - Forward (Vf) (Typ): 2V; Current - Test: 20mA; Viewing Angle: 130°; Lens Color: Colorless; Lens Style/Size: Rectangle with Flat Top, 1.10mm x 0.80mm; Supplier 1: Digi-Key; Manufacturer Part Number: LTST-C190KGKT; RoHS: RoHS Compliant; Category: Optoelectronics; Stock 1: 508935; Pricing 1: 1=0.29, 10=0.223, 100=0.1216, 250=0.08108, 500=0.06892, 1000=0.0527 (EUR); Packaging: Cut Tape (CT); Color: Green; Lens Transparency: Clear; Package / Case: 0603 (1608 Metric); Supplier Device Package: *; Size / Dimension: 1.60mm L x 0.80mm W; Height (Max): 0.80mm; Mounting Type: Surface Mount; ComponentLink1URL: http://optoelectronics.liteon.com/upload/download/DS22-2000-074/S_110_LTST-C190KGKT.pdf; ComponentLink1Description: http://optoelectronics.liteon.com/upload/download/DS22-2000-074/S_110_LTST-C190KGKT.pdf; Supplier Part Number 1: 160-1435-1-ND
R9 = CAT16-101J4LF: RES ARRAY 100 OHM 4 RES 1206; Manufacturer: Bourns Inc.; Circuit Type: Isolated; Resistance (Ohms): 100; Tolerance: ±5%; Number of Resistors: 4; Power Per Element: 62.5mW; Temperature Coefficient: ±200ppm/°C; Supplier 1: Digi-Key; Manufacturer Part Number: CAT16-101J4LF; RoHS: RoHS Compliant; Category: Resistors; Stock 1: 10435; Pricing 1: 1=0.1, 10=0.067, 25=0.0636, 50=0.0602, 100=0.0522, 250=0.05072, 500=0.04586, 1000=0.04194 (EUR); Packaging: Cut Tape (CT); Number of Pins: 8; Operating Temperature: -55°C ~ 125°C; Applications: -; Mounting Type: Surface Mount; Package / Case: 1206 (3216 Metric), Concave, Long Side Terminals; Supplier Device Package: 1206; Size / Dimension: 0.126" L x 0.061" W (3.20mm x 1.55mm); Height: 0.024" (0.60mm); ComponentLink1URL: http://www.bourns.com/data/global/pdfs/CATCAY.pdf; ComponentLink1Description: http://www.bourns.com/data/global/pdfs/CATCAY.pdf; Supplier Part Number 1: CAT16-101J4LFCT-ND
R10-R12 R14 = CRCW06031K00FKEA: as R1 on sheet [04] - IMAGE SENSORS; Supplier 1: Digi-Key; Manufacturer Part Number: CRCW06031K00FKEA; RoHS: RoHS Compliant; Category: Resistors; Stock 1: 831888; Pricing 1: 10=0.077, 50=0.0416, 200=0.02385, 1000=0.01628 (EUR); Packaging: Cut Tape (CT); Resistance (Ohms): 1k; Tolerance: ±1%; Composition: Thick Film; Features: Automotive AEC-Q200; Operating Temperature: -55°C ~ 155°C; Package / Case: 0603 (1608 Metric); Supplier Device Package: 0603 (1608 Metric); Size / Dimension: 0.061" L x 0.033" W (1.55mm x 0.85mm); Height: 0.020" (0.50mm); Number of Terminations: 2; ComponentLink1URL: http://www.vishay.com/docs/20035/dcrcwe3.pdf; ComponentLink1Description: http://www.vishay.com/docs/20035/dcrcwe3.pdf; Supplier Part Number 1: 541-1.00KHCT-ND
R13 R15 = CRCW06033K30FKEA: RES 3.30K OHM 1/10W 1% 0603 SMD; Manufacturer: Vishay Dale; Power (Watts): 0.1W, 1/10W; Temperature Coefficient: ±100ppm/°C; Supplier 1: Digi-Key; Manufacturer Part Number: CRCW06033K30FKEA; RoHS: RoHS Compliant; Category: Resistors; Stock 1: 127044; Pricing 1: 10=0.077, 50=0.0412, 200=0.0236, 1000=0.01612 (EUR); Packaging: Cut Tape (CT); Resistance (Ohms): 3.3k; Tolerance: ±1%; Composition: Thick Film; Features: Automotive AEC-Q200 Qualified; Operating Temperature: -55°C ~ 155°C; Package / Case: 0603 (1608 Metric); Supplier Device Package: 0603 (1608 Metric); Size / Dimension: 0.061" L x 0.033" W (1.55mm x 0.85mm); Height: 0.020" (0.50mm); Number of Terminations: 2; ComponentLink1URL: http://www.vishay.com/docs/20035/dcrcwe3.pdf; ComponentLink1Description: http://www.vishay.com/docs/20035/dcrcwe3.pdf; Supplier Part Number 1: 541-3.30KHCT-ND
U7 U8 = SN74LV4T125PWR: IC BUFF/DVR NON-INVERT 14TSSOP; Manufacturer: Texas Instruments; Logic Type: Buffer/Line Driver, Non-Inverting; Number of Elements: 4; Number of Bits per Element: 1; Current - Output High, Low: 16mA, 16mA; Voltage - Supply: 1.6 V ~ 5.5 V; Supplier 1: Digi-Key; Manufacturer Part Number: SN74LV4T125PWR; RoHS: RoHS Compliant; Category: Integrated Circuits (ICs); Stock 1: 100; Pricing 1: 1=1.02, 10=0.899, 25=0.8112, 100=0.71, 250=0.6226, 500=0.55218, 750=0.48176, 1000=0.43668 (EUR); Packaging: Cut Tape (CT); Operating Temperature: -40°C ~ 125°C; Mounting Type: Surface Mount; Package / Case: 14-TSSOP (0.173", 4.40mm Width); Supplier Device Package: 14-TSSOP; ComponentLink1URL: http://www.ti.com/lit/ds/symlink/sn74lv4t125.pdf; ComponentLink1Description: http://www.ti.com/lit/ds/symlink/sn74lv4t125.pdf; Supplier Part Number 1: 296-40545-1-ND

## Sheet [07] - CONNECTORS 2.SchDoc
size A3; DocumentNumber: 7; SheetNumber: 7; SheetTotal: 9
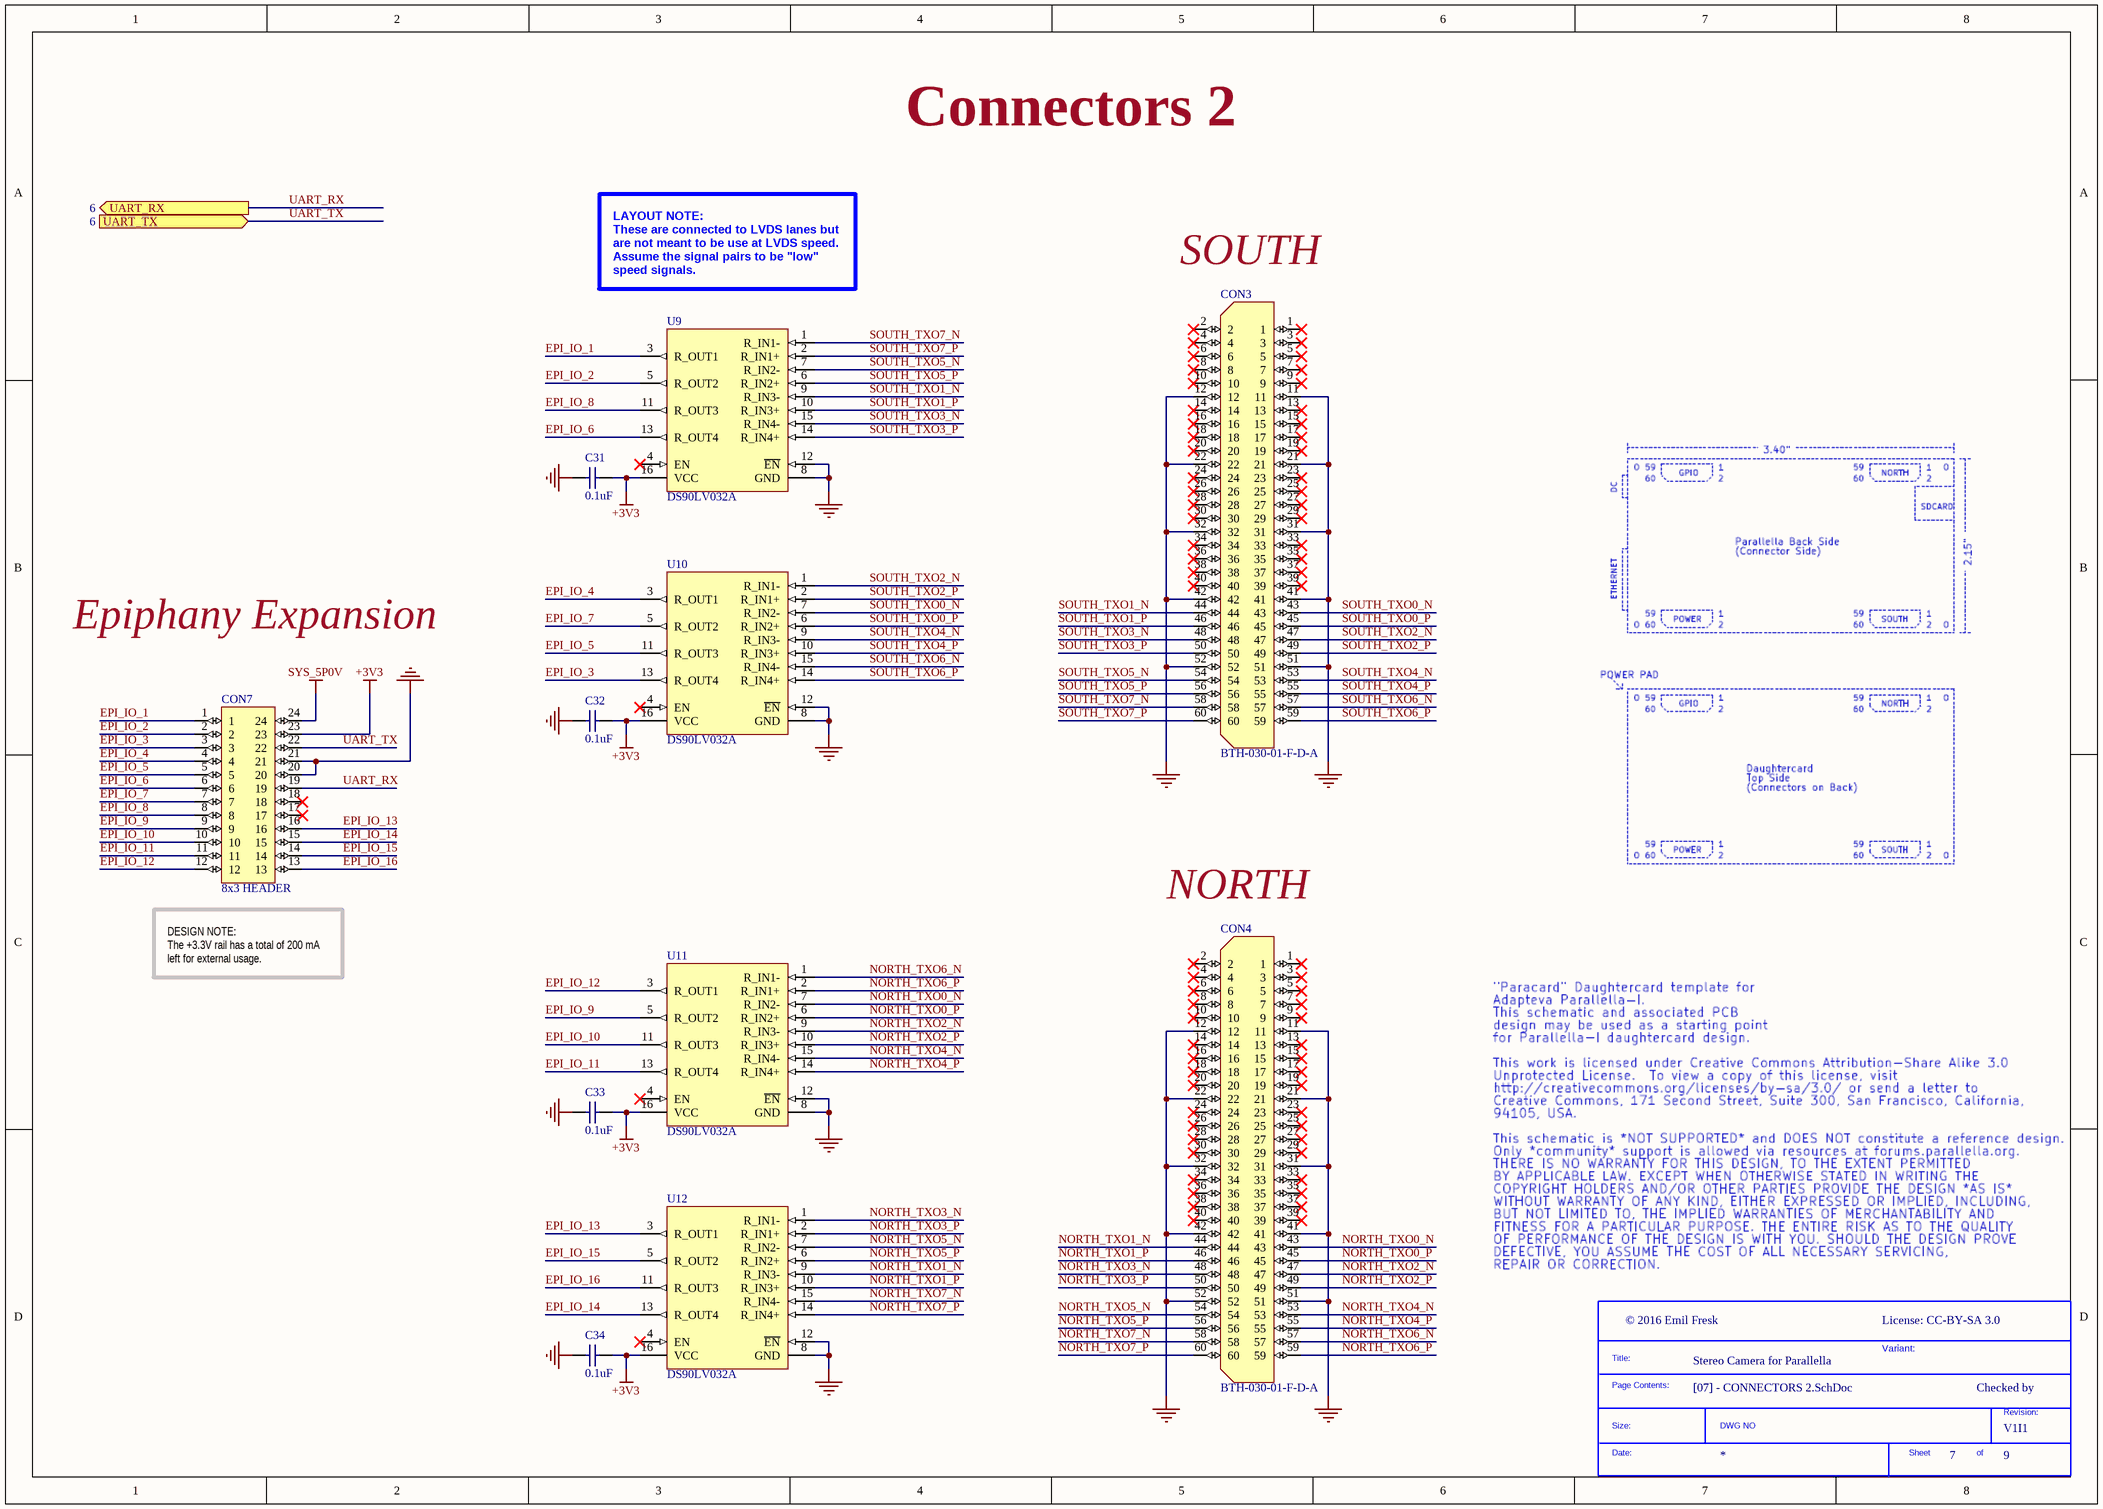
[diagram p8: [07] - CONNECTORS 2.SchDoc]

### Parts
(Parts that share a designator on the sheet are numbered #1, #2 ... from top to bottom, then left to right.)
*#9  SDTitleBlock  (value not drawn)  (graphical)
C31  0.1uF  [C0603L]
C32  0.1uF  [C0603L]
C33  0.1uF  [C0603L]
C34  0.1uF  [C0603L]
CON3  BTH-030-01-F-D-A  [BTH-030-01-X-D-A-K]
CON4  BTH-030-01-F-D-A  [BTH-030-01-X-D-A-K]
CON7  8x3 HEADER  [8x3HEADER_2.54mm]
U9  DS90LV032A  [TSSOP16N]
U10  DS90LV032A  [TSSOP16N]
U11  DS90LV032A  [TSSOP16N]
U12  DS90LV032A  [TSSOP16N]

### Ports
UART_RX (out, see 6), UART_TX (in, see 6)

### Nets
+3V3: C31.2 C32.2 C33.2 C34.2 CON7.23 U9.16(VCC) U10.16(VCC) U11.16(VCC) U12.16(VCC)
GND: C31.1 C32.1 C33.1 C34.1 CON3.11 CON3.12 CON3.21 CON3.22 CON3.31 CON3.32 CON3.41 CON3.42 CON3.51 CON3.52 CON4.11 CON4.12 CON4.21 CON4.22 CON4.31 CON4.32 CON4.41 CON4.42 CON4.51 CON4.52 CON7.20 CON7.21 U9.8(GND) U9.12(~{EN}) U10.8(GND) U10.12(~{EN}) U11.8(GND) U11.12(~{EN}) U12.8(GND) U12.12(~{EN})
SYS_5P0V: CON7.24
EPI_IO_1: CON7.1 U9.3(R_OUT1)
EPI_IO_2: CON7.2 U9.5(R_OUT2)
EPI_IO_3: CON7.3 U10.13(R_OUT4)
EPI_IO_4: CON7.4 U10.3(R_OUT1)
EPI_IO_5: CON7.5 U10.11(R_OUT3)
EPI_IO_6: CON7.6 U9.13(R_OUT4)
EPI_IO_7: CON7.7 U10.5(R_OUT2)
EPI_IO_8: CON7.8 U9.11(R_OUT3)
EPI_IO_9: CON7.9 U11.5(R_OUT2)
EPI_IO_10: CON7.10 U11.11(R_OUT3)
EPI_IO_11: CON7.11 U11.13(R_OUT4)
EPI_IO_12: CON7.12 U11.3(R_OUT1)
EPI_IO_13: CON7.16 U12.3(R_OUT1)
EPI_IO_14: CON7.15 U12.13(R_OUT4)
EPI_IO_15: CON7.14 U12.5(R_OUT2)
EPI_IO_16: CON7.13 U12.11(R_OUT3)
NORTH_TXO0_N: CON4.43 U11.7(R_IN2-)
NORTH_TXO0_P: CON4.45 U11.6(R_IN2+)
NORTH_TXO1_N: CON4.44 U12.9(R_IN3-)
NORTH_TXO1_P: CON4.46 U12.10(R_IN3+)
NORTH_TXO2_N: CON4.47 U11.9(R_IN3-)
NORTH_TXO2_P: CON4.49 U11.10(R_IN3+)
NORTH_TXO3_N: CON4.48 U12.1(R_IN1-)
NORTH_TXO3_P: CON4.50 U12.2(R_IN1+)
NORTH_TXO4_N: CON4.53 U11.15(R_IN4-)
NORTH_TXO4_P: CON4.55 U11.14(R_IN4+)
NORTH_TXO5_N: CON4.54 U12.7(R_IN2-)
NORTH_TXO5_P: CON4.56 U12.6(R_IN2+)
NORTH_TXO6_N: CON4.57 U11.1(R_IN1-)
NORTH_TXO6_P: CON4.59 U11.2(R_IN1+)
NORTH_TXO7_N: CON4.58 U12.15(R_IN4-)
NORTH_TXO7_P: CON4.60 U12.14(R_IN4+)
SOUTH_TXO0_N: CON3.43 U10.7(R_IN2-)
SOUTH_TXO0_P: CON3.45 U10.6(R_IN2+)
SOUTH_TXO1_N: CON3.44 U9.9(R_IN3-)
SOUTH_TXO1_P: CON3.46 U9.10(R_IN3+)
SOUTH_TXO2_N: CON3.47 U10.1(R_IN1-)
SOUTH_TXO2_P: CON3.49 U10.2(R_IN1+)
SOUTH_TXO3_N: CON3.48 U9.15(R_IN4-)
SOUTH_TXO3_P: CON3.50 U9.14(R_IN4+)
SOUTH_TXO4_N: CON3.53 U10.9(R_IN3-)
SOUTH_TXO4_P: CON3.55 U10.10(R_IN3+)
SOUTH_TXO5_N: CON3.54 U9.7(R_IN2-)
SOUTH_TXO5_P: CON3.56 U9.6(R_IN2+)
SOUTH_TXO6_N: CON3.57 U10.15(R_IN4-)
SOUTH_TXO6_P: CON3.59 U10.14(R_IN4+)
SOUTH_TXO7_N: CON3.58 U9.1(R_IN1-)
SOUTH_TXO7_P: CON3.60 U9.2(R_IN1+)
UART_RX: CON7.19 ; port UART_RX
UART_TX: CON7.22 ; port UART_TX

Not connected (* = marked no-connect by the designer): CON3 1* 2* 3* 4* 5* 6* 7* 8* 9* 10* 13* 14* 15* 16* 17* 18* 19* 20* 23* 24* 25* 26* 27* 28* 29* 30* 33* 34* 35* 36* 37* 38* 39* 40*; CON4 1* 2* 3* 4* 5* 6* 7* 8* 9* 10* 13* 14* 15* 16* 17* 18* 19* 20* 23* 24* 25* 26* 27* 28* 29* 30* 33* 34* 35* 36* 37* 38* 39* 40*; CON7 17* 18*; U9 4(EN)*; U10 4(EN)*; U11 4(EN)*; U12 4(EN)*

### Notes on the sheet
- Connectors 2
- LAYOUT NOTE:
  These are connected to LVDS lanes but
  are not meant to be use at LVDS speed.
  Assume the signal pairs to be "low"
  speed signals.
- SOUTH
- Epiphany Expansion
- NORTH
- DESIGN NOTE:
  The +3.3V rail has a total of 200 mA left for external usage.
- Variant:
- Checked by
- (in symbol SDTitleBlock) Title:; Page Contents:; Revision:; Size:; DWG NO; Date:; Sheet; of

### Library data of the parts
C31-C34 = GRM188R71H104KA93J: as C7 on sheet [04] - IMAGE SENSORS; Supplier 1: Digi-Key; Manufacturer Part Number: GRM188R71H104KA93J; RoHS: RoHS Compliant; Category: Capacitors; Stock 1: 4487; Pricing 1: 1=0.12, 10=0.088, 50=0.048, 100=0.0405, 250=0.03316, 500=0.02838, 1000=0.02211, 5000=0.01843 (EUR); Packaging: Cut Tape (CT); Tolerance: ±10%; Voltage - Rated: 50V; Temperature Coefficient: X7R; Mounting Type: Surface Mount, MLCC; Operating Temperature: -55°C ~ 125°C; Applications: General Purpose; Ratings: -; Package / Case: 0603 (1608 Metric); Size / Dimension: 0.063" L x 0.031" W (1.60mm x 0.80mm); Height - Seated (Max): -; Thickness (Max): 0.035" (0.90mm); Lead Spacing: -; Features: -; Lead Style: -; ComponentLink1URL: http://www.murata.com/~/media/webrenewal/support/library/catalog/products/capacitor/mlcc/c02e.ashx; ComponentLink1Description: http://www.murata.com/~/media/webrenewal/support/library/catalog/products/capacitor/mlcc/c02e.ashx; Supplier Part Number 1: 490-9735-1-ND
CON3 CON4 = BTH-030-01-F-D-A: as CON1 on sheet [06] - CONNECTORS 1; Supplier 1: Digi-Key; Manufacturer Part Number: BTH-030-01-F-D-A; RoHS: RoHS Compliant; Category: Connectors, Interconnects; Stock 1: 0; Pricing 1: 1=5.93 (EUR); Packaging: Tray; Number of Rows: 2; Mounting Type: Surface Mount; Features: Board Guide; Contact Finish: Gold; Contact Finish Thickness: Flash; Height Above Board: 0.128" (3.25mm); ComponentLink1URL: http://www.samtec.com/ftppub/cpdf/BSH-XXX-01-X-D-XX-XX-MKT.pdf; ComponentLink1Description: http://www.samtec.com/ftppub/cpdf/BSH-XXX-01-X-D-XX-XX-MKT.pdf; Supplier Part Number 1: BTH-030-01-F-D-A-ND
U9-U12 = DS90LV032ATMTCX/NOPB: IC LINE RVR 3V QUAD DIFF 16TSSOP; Manufacturer: Texas Instruments; Protocol: LVDS; Number of Drivers/Receivers: 0/4; Data Rate: 400Mbps; Voltage - Supply: 3 V ~ 3.6 V; Supplier 1: Digi-Key; Manufacturer Part Number: DS90LV032ATMTCX/NOPB; RoHS: RoHS Compliant; Category: Integrated Circuits (ICs); Stock 1: 2212; Pricing 1: 1=2.63, 10=2.371, 25=2.124, 100=1.9099, 250=1.69584, 500=1.48182, 750=1.34187, 1000=1.22661 (EUR); Packaging: Cut Tape (CT); Type: Receiver; Duplex: -; Receiver Hysteresis: -; Operating Temperature: -40°C ~ 85°C; Mounting Type: Surface Mount; Package / Case: 16-TSSOP (0.173", 4.40mm Width); Supplier Device Package: 16-TSSOP; ComponentLink1URL: http://www.ti.com/lit/ds/symlink/ds90lv032a.pdf; ComponentLink1Description: http://www.ti.com/lit/ds/symlink/ds90lv032a.pdf; Supplier Part Number 1: 296-41254-1-ND